# Altium project APP_1_huom2704.PrjPcb (part 1 of 3)
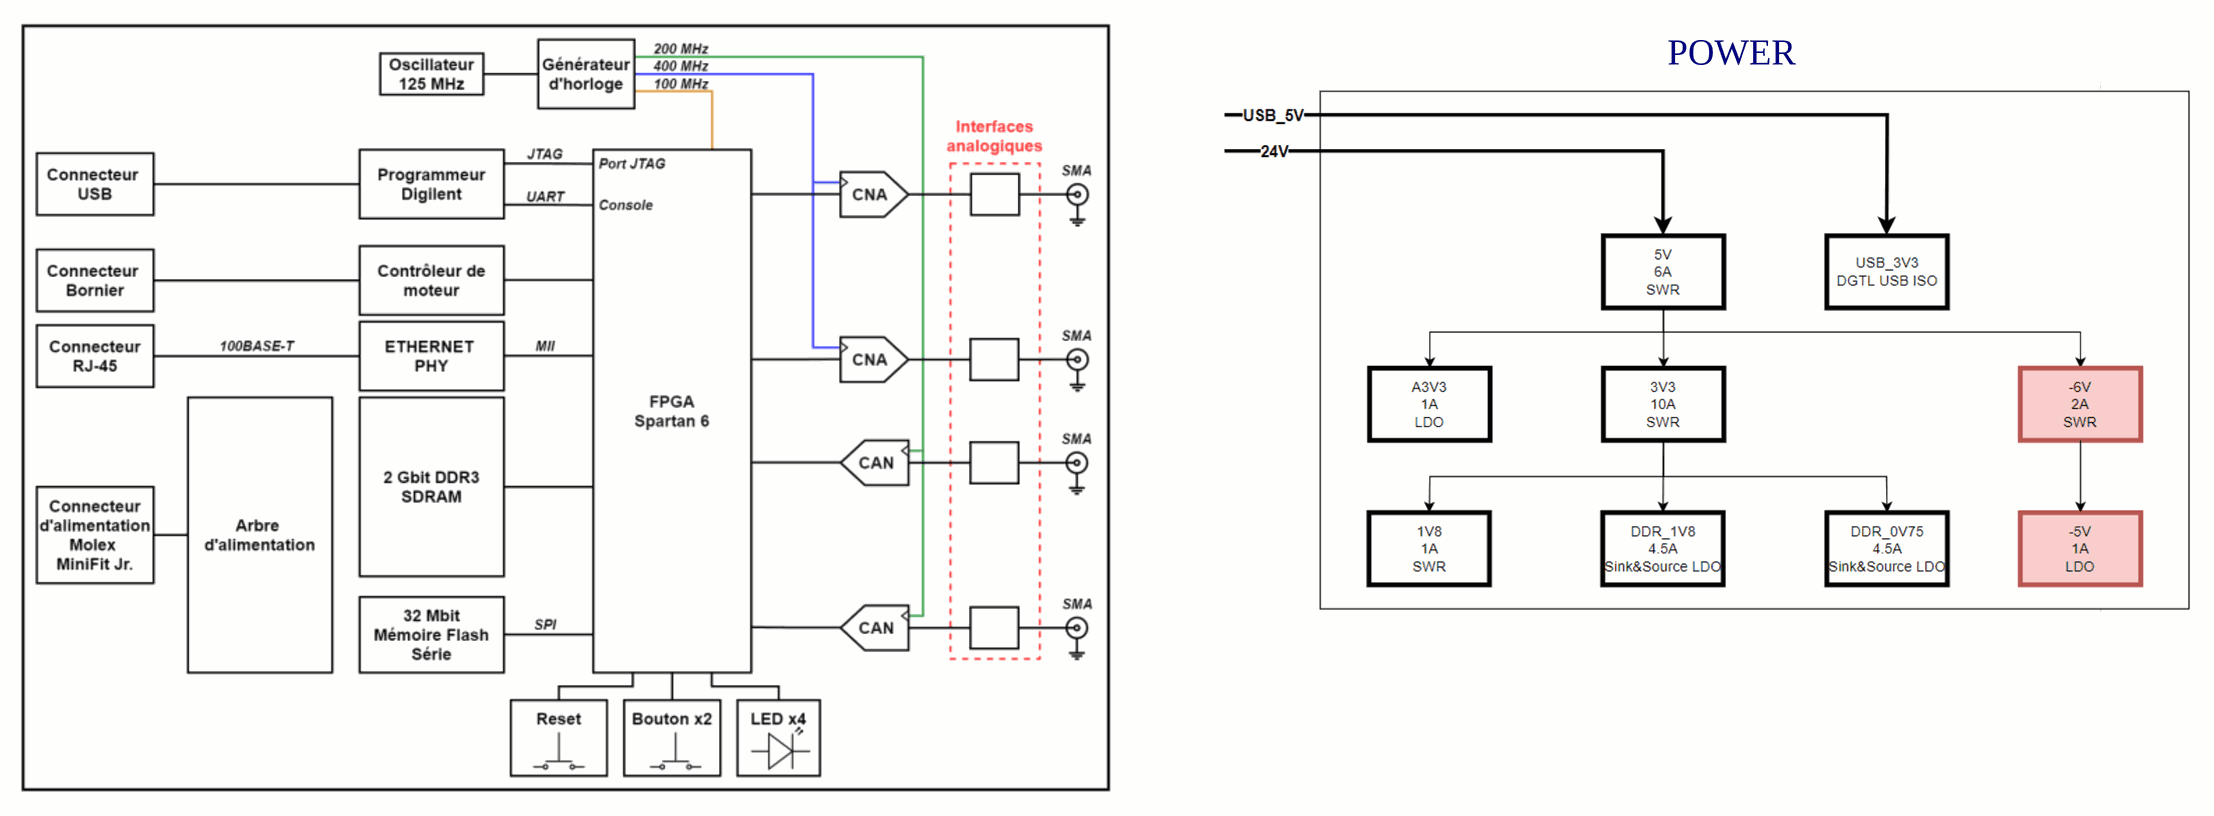
[diagram p0: APP_1_Overview.SchDoc]
Project_Date: 2024-01-12; Project_Designer1: Mathieu Huot; Project_Designer2: Emile Renaud; Project_Global: Conception PCB 1; Project_Group: N/A; Project_Name: APP_1_huom2704_rene0901; Project_Revision: 1.00
16 sheets, 396 parts. Net scope: flat (ports and power ports of the same name join across sheets).
Board files: APP_EMILE.PcbDoc, APP_1_PCB.PcbDoc
Sheets:
  APP_1_Title.SchDoc
  APP_1_Overview.SchDoc
  APP_1_Hiearchic.SchDoc
    FPGA = APP_1_FPGA_m.SchDoc
    DDR3 = APP_1_DDR3_m.SchDoc
    PLL = APP_1_PLL_m.SchDoc
    ADC = APP_1_ADC_m.SchDoc
    Connector = APP_1_Connectors_m.SchDoc
    DriveMoteur = APP_1_DriveMoteur_m.SchDoc
  APP_1_Power_m.SchDoc
  APP_1_Ethernet_m.SchDoc
  APP_1_Flash_m.SchDoc
  APP_1_DAC_m.SchDoc
  APP_1_JTAG_m.SchDoc
  APP_1_PowerAnalog.SchDoc
  APP_1_FPGA_2.SchDoc

## Sheet APP_1_Title.SchDoc
size Tabloid; DocumentNumber: 1; SheetNumber: 1; SheetTotal: 5; Sheet_Name: Insert name in Document Parameters; Size: 11x17

### Notes on the sheet
- Revision history
- Package size conversion
- Metric
- 1005
- 1608
- Imperial
- 0402
- 0603
- Revision
- 2012
- 3216
- 0805
- 1206
- 3225
- 6432
- 1210
- 2512
- Date :
- Project Title
- Global Project
- Size
- Date
- Group
- Sheet
- of
- Filename
- Designers

## Sheet APP_1_Overview.SchDoc: Overview
size Tabloid; DocumentNumber: 2; SheetNumber: 2; SheetTotal: 13; Sheet_Name: Overview; Size: 11x17

### Notes on the sheet
- POWER
- Sheet Name
- Project Title
- Global Project
- Size
- Group
- Revision
- Date
- Sheet
- of
- Filename
- Designers

## Sheet APP_1_Hiearchic.SchDoc
size Tabloid; SheetNumber: 3; SheetTotal: 14; Sheet_Name: Hierarchic; Size: 11x17
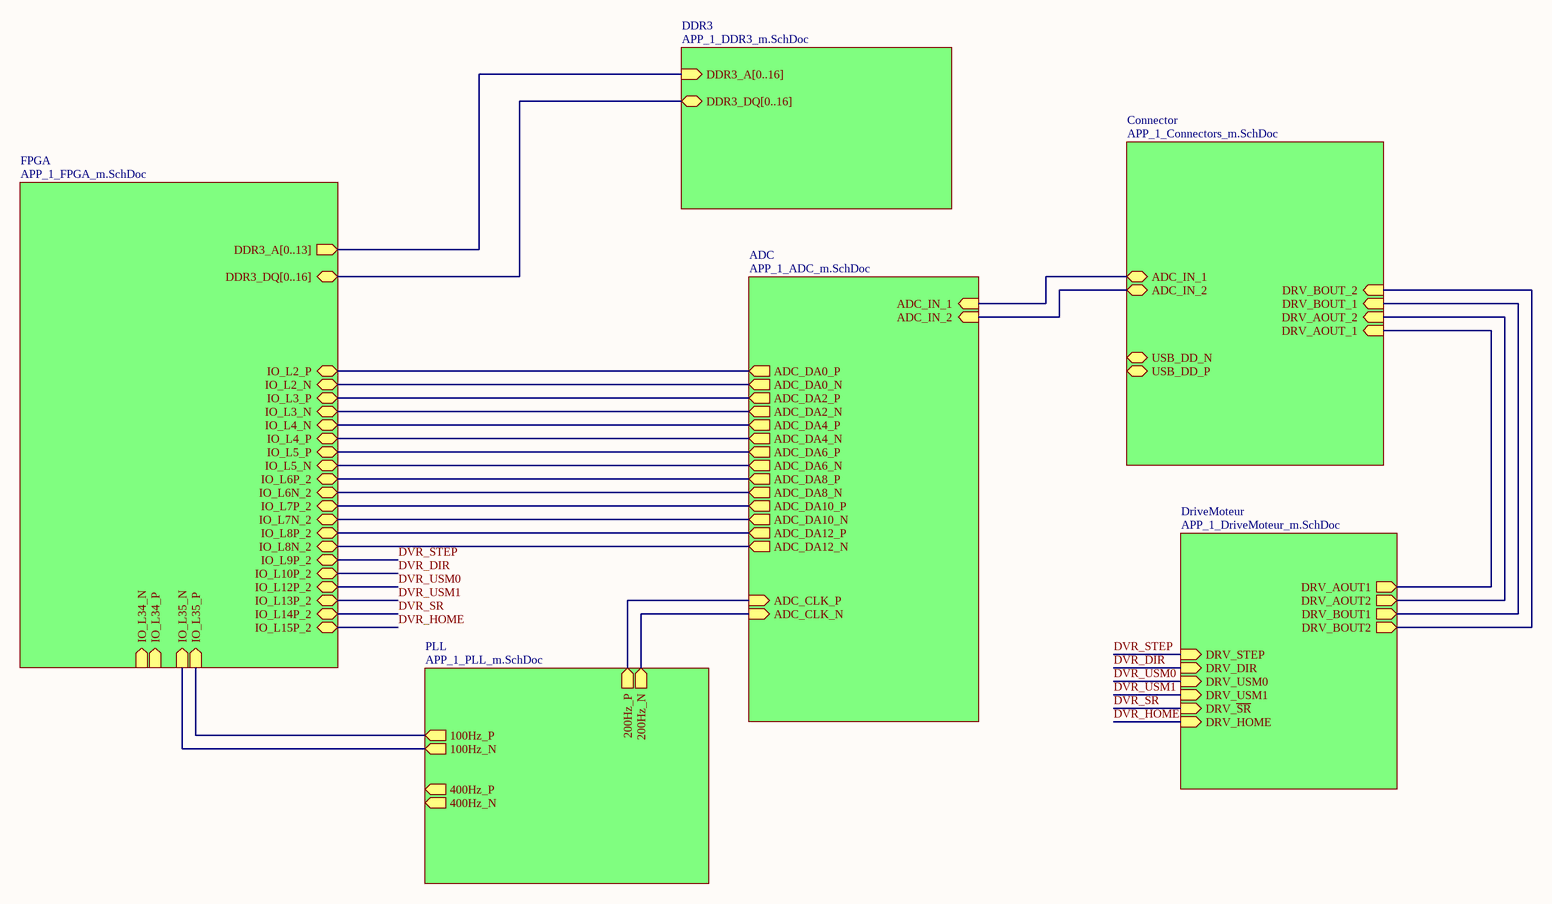
[diagram p1: APP_1_Hiearchic.SchDoc]

### Sub-sheets
ADC = APP_1_ADC_m.SchDoc: ADC_IN_1 (in), ADC_IN_2 (in), ADC_CLK_P (in), ADC_CLK_N (in), ADC_DA0_P (out), ADC_DA0_N (out), ADC_DA2_P (out), ADC_DA2_N (out), ADC_DA4_P (out), ADC_DA4_N (out), ADC_DA6_P (out), ADC_DA6_N (out), ADC_DA8_P (out), ADC_DA8_N (out), ADC_DA10_P (out), ADC_DA10_N (out), ADC_DA12_P (out), ADC_DA12_N (out)
Connector = APP_1_Connectors_m.SchDoc: ADC_IN_1 (bidir), ADC_IN_2 (bidir), DRV_AOUT_1 (in), DRV_AOUT_2 (in), DRV_BOUT_1 (in), DRV_BOUT_2 (in), USB_DD_P (bidir), USB_DD_N (bidir)
DDR3 = APP_1_DDR3_m.SchDoc: DDR3_A[0..16] (in), DDR3_DQ[0..16] (bidir)
DriveMoteur = APP_1_DriveMoteur_m.SchDoc: DRV_AOUT1 (out), DRV_AOUT2 (out), DRV_BOUT1 (out), DRV_BOUT2 (out), DRV_STEP (in), DRV_DIR (in), DRV_USM0 (in), DRV_USM1 (in), DRV_~{SR} (in), DRV_HOME (in)
FPGA = APP_1_FPGA_m.SchDoc: DDR3_A[0..13] (out), DDR3_DQ[0..16] (bidir), IO_L34_N (in), IO_L34_P (in), IO_L35_P (in), IO_L35_N (in), IO_L2_P (bidir), IO_L2_N (bidir), IO_L3_P (bidir), IO_L3_N (bidir), IO_L4_N (bidir), IO_L4_P (bidir), IO_L5_P (bidir), IO_L5_N (bidir), IO_L6P_2 (bidir), IO_L6N_2 (bidir), IO_L7P_2 (bidir), IO_L7N_2 (bidir), IO_L8P_2 (bidir), IO_L8N_2 (bidir), IO_L9P_2 (bidir), IO_L10P_2 (bidir), IO_L12P_2 (bidir), IO_L13P_2 (bidir), IO_L14P_2 (bidir), IO_L15P_2 (bidir)
PLL = APP_1_PLL_m.SchDoc: 100Hz_P (out), 100Hz_N (out), 200Hz_P (out), 200Hz_N (out), 400Hz_P (out), 400Hz_N (out)

### Nets
DVR_DIR: sheet FPGA/IO_L10P_2, sheet DriveMoteur/DRV_DIR
DVR_HOME: sheet FPGA/IO_L15P_2, sheet DriveMoteur/DRV_HOME
DVR_SR: sheet FPGA/IO_L14P_2, sheet DriveMoteur/DRV_~{SR}
DVR_STEP: sheet FPGA/IO_L9P_2, sheet DriveMoteur/DRV_STEP
DVR_USM0: sheet FPGA/IO_L12P_2, sheet DriveMoteur/DRV_USM0
DVR_USM1: sheet FPGA/IO_L13P_2, sheet DriveMoteur/DRV_USM1
(unnamed): sheet FPGA/IO_L35_P, sheet PLL/100Hz_P
(unnamed): sheet FPGA/IO_L35_N, sheet PLL/100Hz_N
(unnamed): sheet FPGA/IO_L2_P, sheet ADC/ADC_DA0_P
(unnamed): sheet FPGA/IO_L2_N, sheet ADC/ADC_DA0_N
(unnamed): sheet FPGA/IO_L3_P, sheet ADC/ADC_DA2_P
(unnamed): sheet FPGA/IO_L3_N, sheet ADC/ADC_DA2_N
(unnamed): sheet FPGA/IO_L4_N, sheet ADC/ADC_DA4_P
(unnamed): sheet FPGA/IO_L4_P, sheet ADC/ADC_DA4_N
(unnamed): sheet FPGA/IO_L5_P, sheet ADC/ADC_DA6_P
(unnamed): sheet FPGA/IO_L5_N, sheet ADC/ADC_DA6_N
(unnamed): sheet FPGA/IO_L6P_2, sheet ADC/ADC_DA8_P
(unnamed): sheet FPGA/IO_L6N_2, sheet ADC/ADC_DA8_N
(unnamed): sheet FPGA/IO_L7P_2, sheet ADC/ADC_DA10_P
(unnamed): sheet FPGA/IO_L7N_2, sheet ADC/ADC_DA10_N
(unnamed): sheet FPGA/IO_L8P_2, sheet ADC/ADC_DA12_P
(unnamed): sheet FPGA/IO_L8N_2, sheet ADC/ADC_DA12_N
(unnamed): sheet PLL/200Hz_P, sheet ADC/ADC_CLK_P
(unnamed): sheet PLL/200Hz_N, sheet ADC/ADC_CLK_N
(unnamed): sheet ADC/ADC_IN_1, sheet Connector/ADC_IN_1
(unnamed): sheet ADC/ADC_IN_2, sheet Connector/ADC_IN_2
(unnamed): sheet Connector/DRV_AOUT_1, sheet DriveMoteur/DRV_AOUT1
(unnamed): sheet Connector/DRV_AOUT_2, sheet DriveMoteur/DRV_AOUT2
(unnamed): sheet Connector/DRV_BOUT_1, sheet DriveMoteur/DRV_BOUT1
(unnamed): sheet Connector/DRV_BOUT_2, sheet DriveMoteur/DRV_BOUT2

### Buses and harness runs
bus sheet DDR3/DDR3_A[0..16] = sheet FPGA/DDR3_A[0..13]
bus sheet DDR3/DDR3_DQ[0..16] = sheet FPGA/DDR3_DQ[0..16]

### Notes on the sheet
- Sheet Name
- Project Title
- Global Project
- Size
- Group
- Revision
- Date
- Sheet
- of
- Filename
- Designers

## Sheet APP_1_FPGA_m.SchDoc
size Tabloid; SheetNumber: 5; SheetTotal: 16; Sheet_Name: FPGA_m; Size: 11x17
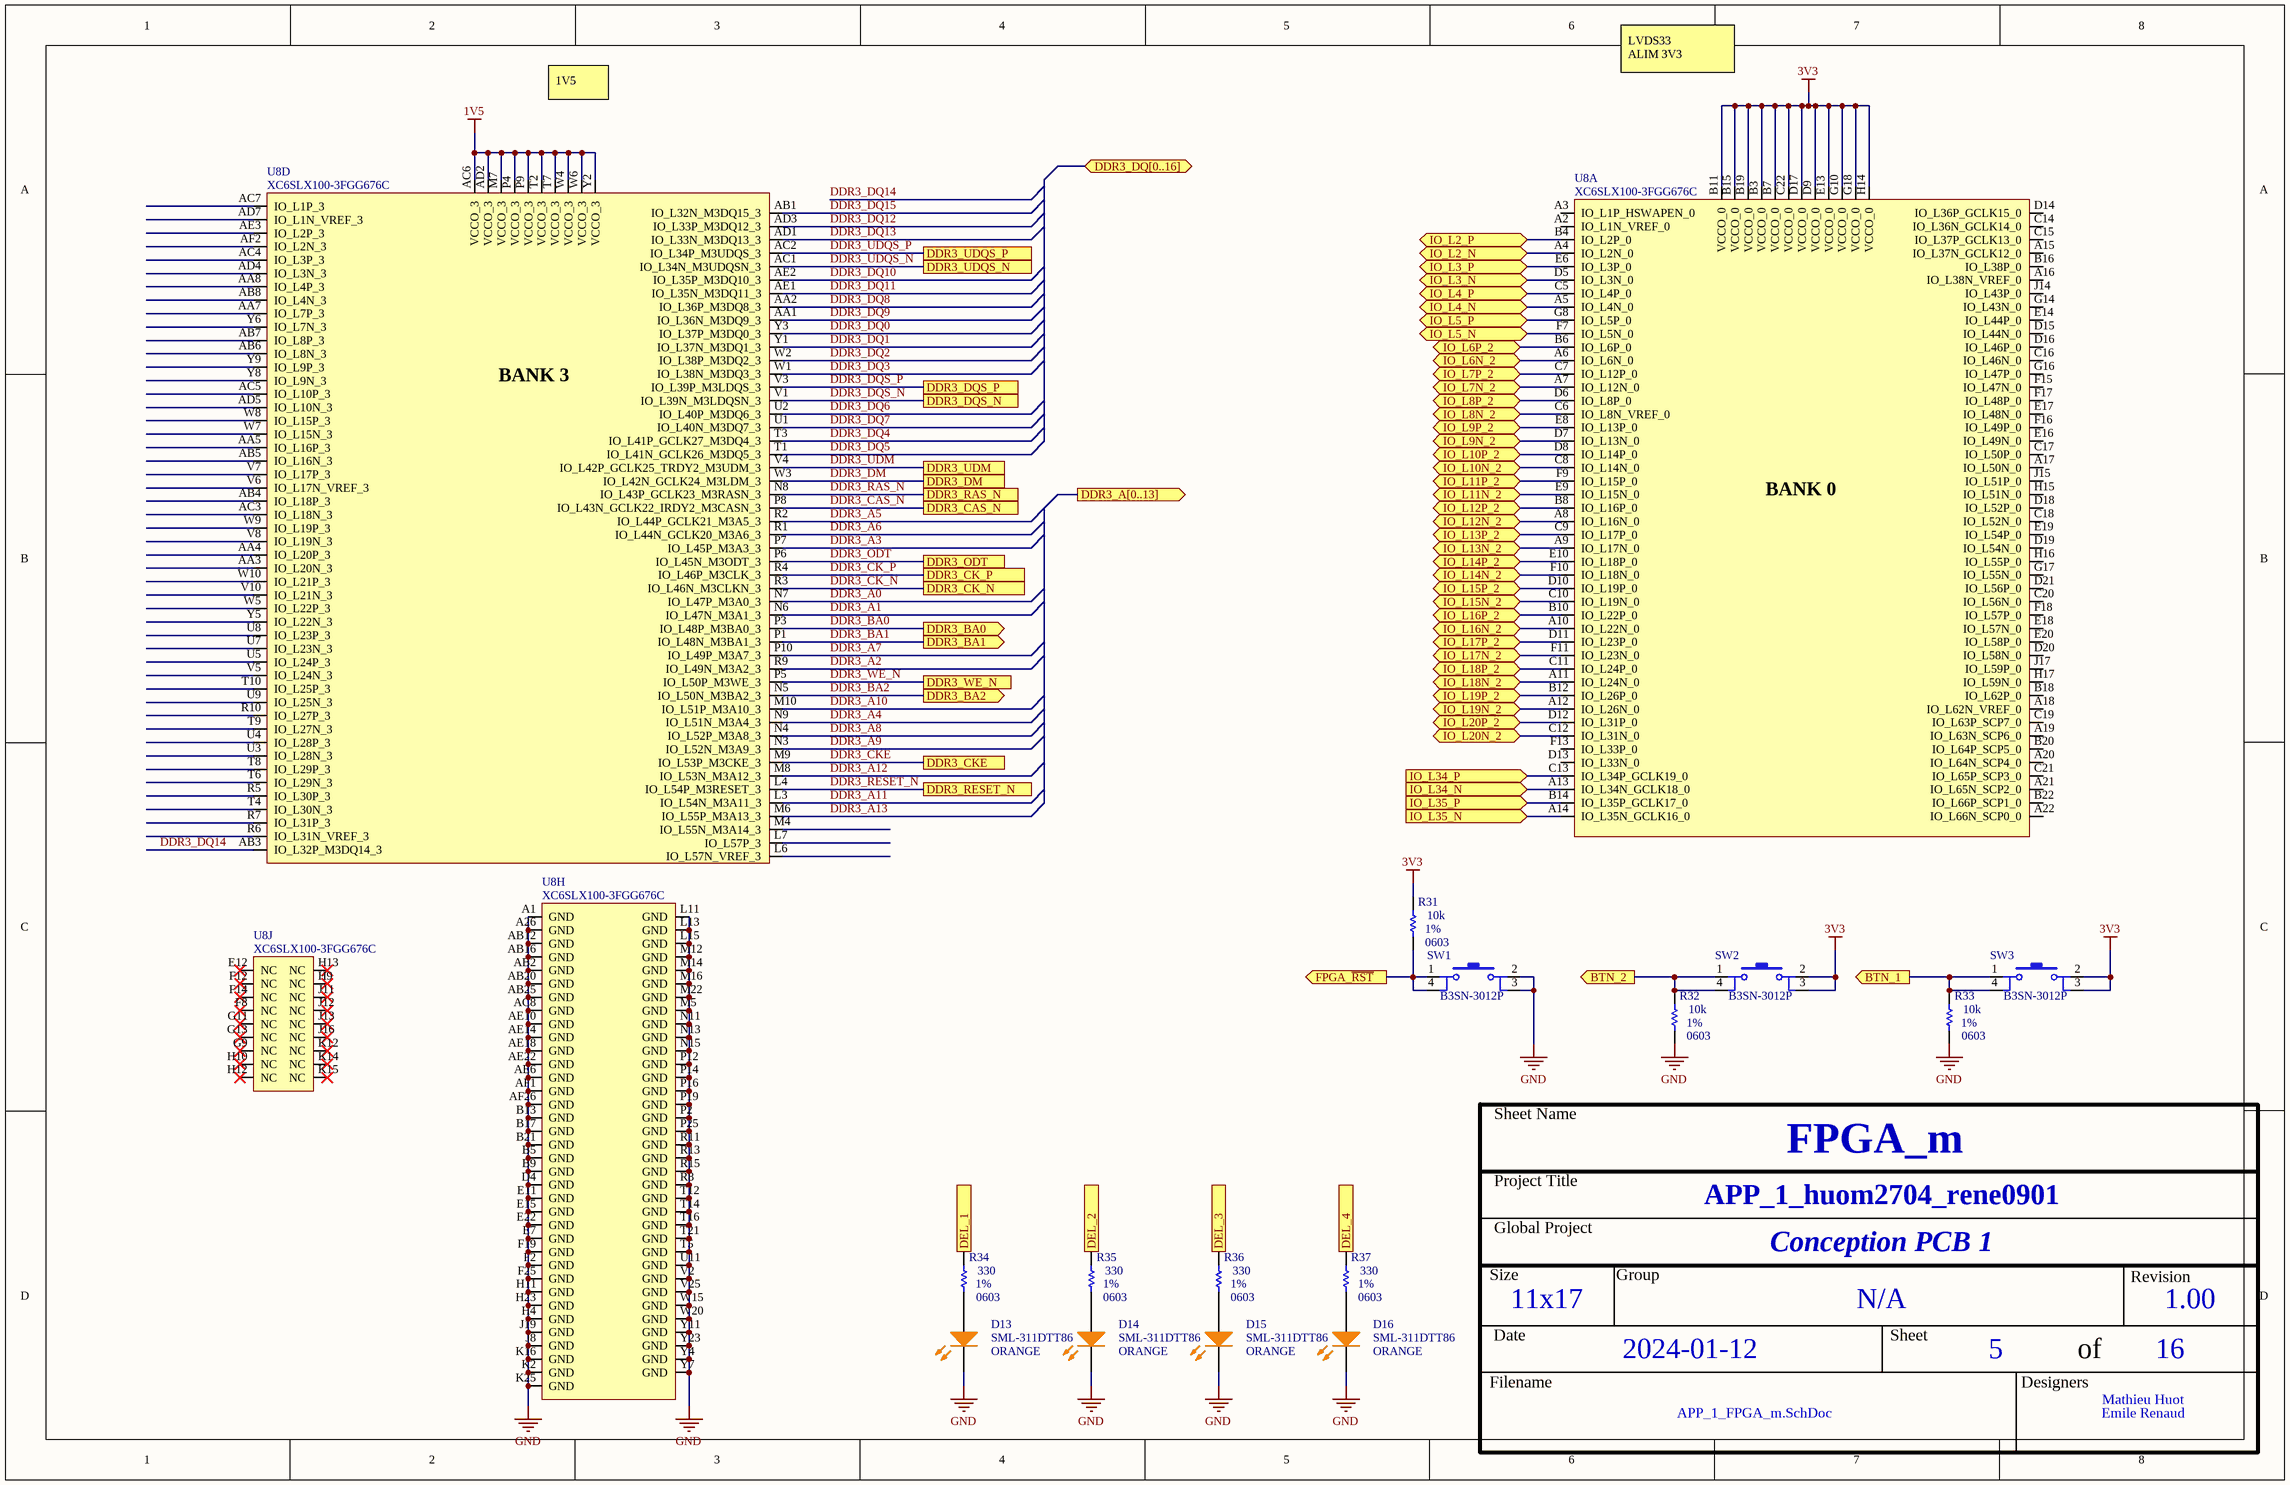
[diagram p2: APP_1_FPGA_m.SchDoc]

### Parts
D13  SML-311DTT86  value ORANGE  [LED_0603]
D14  SML-311DTT86  value ORANGE  [LED_0603]
D15  SML-311DTT86  value ORANGE  [LED_0603]
D16  SML-311DTT86  value ORANGE  [LED_0603]
R31  value 10k  Package: 0603  Precision: 1%  [RES_0603]  (hidden comment: RES - 0603)
R32  value 10k  Package: 0603  Precision: 1%  [RES_0603]  (hidden comment: RES - 0603)
R33  value 10k  Package: 0603  Precision: 1%  [RES_0603]  (hidden comment: RES - 0603)
R34  value 330  Package: 0603  Precision: 1%  [RES_0603]  (hidden comment: RES - 0603)
R35  value 330  Package: 0603  Precision: 1%  [RES_0603]  (hidden comment: RES - 0603)
R36  value 330  Package: 0603  Precision: 1%  [RES_0603]  (hidden comment: RES - 0603)
R37  value 330  Package: 0603  Precision: 1%  [RES_0603]  (hidden comment: RES - 0603)
SW1  B3SN-3012P  [SWI_TACT_B3SN-3012P]
SW2  B3SN-3012P  [SWI_TACT_B3SN-3012P]
SW3  B3SN-3012P  [SWI_TACT_B3SN-3012P]
U8  XC6SLX100-3FGG676C  [FPGA_XILINX_FGG676]  (parts A,D,H,J of 10)

### Ports
BTN_1 (out), BTN_2 (out), DDR3_A[0..13] (out, see APP_1_DDR3_m[1B]), DDR3_BA0 (out, see APP_1_DDR3_m[2C]), DDR3_BA1 (out, see APP_1_DDR3_m[2C]), DDR3_BA2 (out, see APP_1_DDR3_m[2C]), DDR3_CAS_N (see APP_1_DDR3_m[2C]), DDR3_CK_N (see APP_1_DDR3_m[1C]), DDR3_CK_P (see APP_1_DDR3_m[1C]), DDR3_CKE, DDR3_DM, DDR3_DQ[0..16] (bidir, see APP_1_DDR3_m[4B]), DDR3_DQS_N, DDR3_DQS_P, DDR3_ODT (see APP_1_DDR3_m[2C]), DDR3_RAS_N (see APP_1_DDR3_m[2C]), DDR3_RESET_N, DDR3_UDM (see APP_1_DDR3_m[4C]), DDR3_UDQS_N (see APP_1_DDR3_m[4C]), DDR3_UDQS_P (see APP_1_DDR3_m[4C]), DDR3_WE_N (see APP_1_DDR3_m[2C]), DEL_1, DEL_2, DEL_3, DEL_4, FPGA_~{RST} (out), IO_L2_N (bidir), IO_L2_P (bidir), IO_L3_N (bidir), IO_L3_P (bidir), IO_L4_N (bidir), IO_L4_P (bidir), IO_L5_N (bidir), IO_L5_P (bidir), IO_L6N_2 (bidir), IO_L6P_2 (bidir), IO_L7N_2 (bidir), IO_L7P_2 (bidir), IO_L8N_2 (bidir), IO_L8P_2 (bidir), IO_L9N_2 (bidir), IO_L9P_2 (bidir), IO_L10N_2 (bidir), IO_L10P_2 (bidir), IO_L11N_2 (bidir), IO_L11P_2 (bidir), IO_L12N_2 (bidir), IO_L12P_2 (bidir), IO_L13N_2 (bidir), IO_L13P_2 (bidir), IO_L14N_2 (bidir), IO_L14P_2 (bidir), IO_L15N_2 (bidir), IO_L15P_2 (bidir), IO_L16N_2 (bidir), IO_L16P_2 (bidir), IO_L17N_2 (bidir), IO_L17P_2 (bidir), IO_L18N_2 (bidir), IO_L18P_2 (bidir), IO_L19N_2 (bidir), IO_L19P_2 (bidir), IO_L20N_2 (bidir), IO_L20P_2 (bidir), IO_L34_N (in), IO_L34_P (in), IO_L35_N (in), IO_L35_P (in)

### Nets
1V5: U8.AC6(VCCO_3) U8.AD2(VCCO_3) U8.M7(VCCO_3) U8.P4(VCCO_3) U8.P9(VCCO_3) U8.T2(VCCO_3) U8.T7(VCCO_3) U8.W4(VCCO_3) U8.W6(VCCO_3) U8.Y2(VCCO_3)
3V3: R31.2 SW2.2 SW2.3 SW3.2 SW3.3 U8.B3(VCCO_0) U8.B7(VCCO_0) U8.B11(VCCO_0) U8.B15(VCCO_0) U8.B19(VCCO_0) U8.C22(VCCO_0) U8.D9(VCCO_0) U8.D17(VCCO_0) U8.E13(VCCO_0) U8.G10(VCCO_0) U8.G18(VCCO_0) U8.H14(VCCO_0)
GND: D13.K D14.K D15.K D16.K R32.1 R33.1 SW1.2 SW1.3 U8.A1(GND) U8.A26(GND) U8.AB2(GND) U8.AB12(GND) U8.AB16(GND) U8.AB20(GND) U8.AB25(GND) U8.AC8(GND) U8.AE6(GND) U8.AE10(GND) U8.AE14(GND) U8.AE18(GND) U8.AE22(GND) U8.AF1(GND) U8.AF26(GND) U8.B5(GND) U8.B9(GND) U8.B13(GND) U8.B17(GND) U8.B21(GND) U8.D4(GND) U8.E7(GND) U8.E11(GND) U8.E15(GND) U8.E22(GND) U8.F2(GND) U8.F19(GND) U8.F25(GND) U8.H4(GND) U8.H11(GND) U8.H23(GND) U8.J8(GND) U8.J19(GND) U8.K2(GND) U8.K16(GND) U8.K25(GND) U8.L11(GND) U8.L13(GND) U8.L15(GND) U8.M5(GND) U8.M12(GND) U8.M14(GND) U8.M16(GND) U8.M22(GND) U8.N11(GND) U8.N13(GND) U8.N15(GND) U8.P2(GND) U8.P12(GND) U8.P14(GND) U8.P16(GND) U8.P19(GND) U8.P25(GND) U8.R8(GND) U8.R11(GND) U8.R13(GND) U8.R15(GND) U8.T5(GND) U8.T12(GND) U8.T14(GND) U8.T16(GND) U8.T21(GND) U8.U11(GND) U8.V2(GND) U8.V25(GND) U8.W15(GND) U8.W20(GND) U8.Y4(GND) U8.Y7(GND) U8.Y11(GND) U8.Y23(GND)
BTN_1: R33.2 SW3.1 SW3.4 ; port BTN_1
BTN_2: R32.2 SW2.1 SW2.4 ; port BTN_2
DDR3_A0: U8.N7(IO_L47P_M3A0_3)
DDR3_A1: U8.N6(IO_L47N_M3A1_3)
DDR3_A2: U8.R9(IO_L49N_M3A2_3)
DDR3_A3: U8.P7(IO_L45P_M3A3_3)
DDR3_A4: U8.N9(IO_L51N_M3A4_3)
DDR3_A5: U8.R2(IO_L44P_GCLK21_M3A5_3)
DDR3_A6: U8.R1(IO_L44N_GCLK20_M3A6_3)
DDR3_A7: U8.P10(IO_L49P_M3A7_3)
DDR3_A8: U8.N4(IO_L52P_M3A8_3)
DDR3_A9: U8.N3(IO_L52N_M3A9_3)
DDR3_A10: U8.M10(IO_L51P_M3A10_3)
DDR3_A11: U8.L3(IO_L54N_M3A11_3)
DDR3_A12: U8.M8(IO_L53N_M3A12_3)
DDR3_A13: U8.M6(IO_L55P_M3A13_3)
DDR3_BA0: U8.P3(IO_L48P_M3BA0_3) ; port DDR3_BA0
DDR3_BA1: U8.P1(IO_L48N_M3BA1_3) ; port DDR3_BA1
DDR3_BA2: U8.N5(IO_L50N_M3BA2_3) ; port DDR3_BA2
DDR3_CAS_N: U8.P8(IO_L43N_GCLK22_IRDY2_M3CASN_3) ; port DDR3_CAS_N
DDR3_CK_N: U8.R3(IO_L46N_M3CLKN_3) ; port DDR3_CK_N
DDR3_CK_P: U8.R4(IO_L46P_M3CLK_3) ; port DDR3_CK_P
DDR3_CKE: U8.M9(IO_L53P_M3CKE_3) ; port DDR3_CKE
DDR3_DM: U8.W3(IO_L42N_GCLK24_M3LDM_3) ; port DDR3_DM
DDR3_DQ0: U8.Y3(IO_L37P_M3DQ0_3)
DDR3_DQ1: U8.Y1(IO_L37N_M3DQ1_3)
DDR3_DQ2: U8.W2(IO_L38P_M3DQ2_3)
DDR3_DQ3: U8.W1(IO_L38N_M3DQ3_3)
DDR3_DQ4: U8.T3(IO_L41P_GCLK27_M3DQ4_3)
DDR3_DQ5: U8.T1(IO_L41N_GCLK26_M3DQ5_3)
DDR3_DQ6: U8.U2(IO_L40P_M3DQ6_3)
DDR3_DQ7: U8.U1(IO_L40N_M3DQ7_3)
DDR3_DQ8: U8.AA2(IO_L36P_M3DQ8_3)
DDR3_DQ9: U8.AA1(IO_L36N_M3DQ9_3)
DDR3_DQ10: U8.AE2(IO_L35P_M3DQ10_3)
DDR3_DQ11: U8.AE1(IO_L35N_M3DQ11_3)
DDR3_DQ12: U8.AD3(IO_L33P_M3DQ12_3)
DDR3_DQ13: U8.AD1(IO_L33N_M3DQ13_3)
DDR3_DQ14: U8.AB3(IO_L32P_M3DQ14_3)
DDR3_DQ15: U8.AB1(IO_L32N_M3DQ15_3)
DDR3_DQS_N: U8.V1(IO_L39N_M3LDQSN_3) ; port DDR3_DQS_N
DDR3_DQS_P: U8.V3(IO_L39P_M3LDQS_3) ; port DDR3_DQS_P
DDR3_ODT: U8.P6(IO_L45N_M3ODT_3) ; port DDR3_ODT
DDR3_RAS_N: U8.N8(IO_L43P_GCLK23_M3RASN_3) ; port DDR3_RAS_N
DDR3_RESET_N: U8.L4(IO_L54P_M3RESET_3) ; port DDR3_RESET_N
DDR3_UDM: U8.V4(IO_L42P_GCLK25_TRDY2_M3UDM_3) ; port DDR3_UDM
DDR3_UDQS_N: U8.AC1(IO_L34N_M3UDQSN_3) ; port DDR3_UDQS_N
DDR3_UDQS_P: U8.AC2(IO_L34P_M3UDQS_3) ; port DDR3_UDQS_P
DDR3_WE_N: U8.P5(IO_L50P_M3WE_3) ; port DDR3_WE_N
DEL_1: R34.2 ; port DEL_1
DEL_2: R35.2 ; port DEL_2
DEL_3: R36.2 ; port DEL_3
DEL_4: R37.2 ; port DEL_4
FPGA_~{RST}: R31.1 SW1.1 SW1.4 ; port FPGA_~{RST}
IO_L2_N: U8.A4(IO_L2N_0) ; port IO_L2_N
IO_L2_P: U8.B4(IO_L2P_0) ; port IO_L2_P
IO_L3_N: U8.D5(IO_L3N_0) ; port IO_L3_N
IO_L3_P: U8.E6(IO_L3P_0) ; port IO_L3_P
IO_L4_N: U8.A5(IO_L4N_0) ; port IO_L4_N
IO_L4_P: U8.C5(IO_L4P_0) ; port IO_L4_P
IO_L5_N: U8.F7(IO_L5N_0) ; port IO_L5_N
IO_L5_P: U8.G8(IO_L5P_0) ; port IO_L5_P
IO_L6N_2: U8.A6(IO_L6N_0) ; port IO_L6N_2
IO_L6P_2: U8.B6(IO_L6P_0) ; port IO_L6P_2
IO_L7N_2: U8.A7(IO_L12N_0) ; port IO_L7N_2
IO_L7P_2: U8.C7(IO_L12P_0) ; port IO_L7P_2
IO_L8N_2: U8.C6(IO_L8N_VREF_0) ; port IO_L8N_2
IO_L8P_2: U8.D6(IO_L8P_0) ; port IO_L8P_2
IO_L9N_2: U8.D7(IO_L13N_0) ; port IO_L9N_2
IO_L9P_2: U8.E8(IO_L13P_0) ; port IO_L9P_2
IO_L10N_2: U8.C8(IO_L14N_0) ; port IO_L10N_2
IO_L10P_2: U8.D8(IO_L14P_0) ; port IO_L10P_2
IO_L11N_2: U8.E9(IO_L15N_0) ; port IO_L11N_2
IO_L11P_2: U8.F9(IO_L15P_0) ; port IO_L11P_2
IO_L12N_2: U8.A8(IO_L16N_0) ; port IO_L12N_2
IO_L12P_2: U8.B8(IO_L16P_0) ; port IO_L12P_2
IO_L13N_2: U8.A9(IO_L17N_0) ; port IO_L13N_2
IO_L13P_2: U8.C9(IO_L17P_0) ; port IO_L13P_2
IO_L14N_2: U8.F10(IO_L18N_0) ; port IO_L14N_2
IO_L14P_2: U8.E10(IO_L18P_0) ; port IO_L14P_2
IO_L15N_2: U8.C10(IO_L19N_0) ; port IO_L15N_2
IO_L15P_2: U8.D10(IO_L19P_0) ; port IO_L15P_2
IO_L16N_2: U8.A10(IO_L22N_0) ; port IO_L16N_2
IO_L16P_2: U8.B10(IO_L22P_0) ; port IO_L16P_2
IO_L17N_2: U8.F11(IO_L23N_0) ; port IO_L17N_2
IO_L17P_2: U8.D11(IO_L23P_0) ; port IO_L17P_2
IO_L18N_2: U8.A11(IO_L24N_0) ; port IO_L18N_2
IO_L18P_2: U8.C11(IO_L24P_0) ; port IO_L18P_2
IO_L19N_2: U8.A12(IO_L26N_0) ; port IO_L19N_2
IO_L19P_2: U8.B12(IO_L26P_0) ; port IO_L19P_2
IO_L20N_2: U8.C12(IO_L31N_0) ; port IO_L20N_2
IO_L20P_2: U8.D12(IO_L31P_0) ; port IO_L20P_2
IO_L34_N: U8.A13(IO_L34N_GCLK18_0) ; port IO_L34_N
IO_L34_P: U8.C13(IO_L34P_GCLK19_0) ; port IO_L34_P
IO_L35_N: U8.A14(IO_L35N_GCLK16_0) ; port IO_L35_N
IO_L35_P: U8.B14(IO_L35P_GCLK17_0) ; port IO_L35_P
NetD13_A: D13.A R34.1
NetD14_A: D14.A R35.1
NetD15_A: D15.A R36.1
NetD16_A: D16.A R37.1

Not connected (* = marked no-connect by the designer): U8 A2(IO_L1N_VREF_0) A3(IO_L1P_HSWAPEN_0) A15(IO_L37N_GCLK12_0) A16(IO_L38N_VREF_0) A17(IO_L50N_0) A18(IO_L62N_VREF_0) A19(IO_L63N_SCP6_0) A20(IO_L64N_SCP4_0) A21(IO_L65N_SCP2_0) A22(IO_L66N_SCP0_0) AA3(IO_L20N_3) AA4(IO_L20P_3) AA5(IO_L16P_3) AA7(IO_L7P_3) AA8(IO_L4P_3) AB4(IO_L18P_3) AB5(IO_L16N_3) AB6(IO_L8N_3) AB7(IO_L8P_3) AB8(IO_L4N_3) AC3(IO_L18N_3) AC4(IO_L3P_3) AC5(IO_L10P_3) AC7(IO_L1P_3) AD4(IO_L3N_3) AD5(IO_L10N_3) AD7(IO_L1N_VREF_3) AE3(IO_L2P_3) AF2(IO_L2N_3) B16(IO_L38P_0) B18(IO_L62P_0) B20(IO_L64P_SCP5_0) B22(IO_L66P_SCP1_0) C14(IO_L36N_GCLK14_0) C15(IO_L37P_GCLK13_0) C16(IO_L46N_0) C17(IO_L50P_0) C18(IO_L52N_0) C19(IO_L63P_SCP7_0) C20(IO_L56N_0) C21(IO_L65P_SCP3_0) D13(IO_L33N_0) D14(IO_L36P_GCLK15_0) D15(IO_L44N_0) D16(IO_L46P_0) D18(IO_L52P_0) D19(IO_L54N_0) D20(IO_L58N_0) D21(IO_L56P_0) E12(NC)* E14(IO_L44P_0) E16(IO_L49N_0) E17(IO_L48N_0) E18(IO_L57N_0) E19(IO_L54P_0) E20(IO_L58P_0) F8(NC)* F12(NC)* F13(IO_L33P_0) F14(NC)* F15(IO_L47N_0) F16(IO_L49P_0) F17(IO_L48P_0) F18(IO_L57P_0) G9(NC)* G11(NC)* G13(NC)* G14(IO_L43N_0) G16(IO_L47P_0) G17(IO_L55N_0) H9(NC)* H10(NC)* H12(NC)* H13(NC)* H15(IO_L51N_0) H16(IO_L55P_0) H17(IO_L59N_0) J11(NC)* J12(NC)* J13(NC)* J14(IO_L43P_0) J15(IO_L51P_0) J16(NC)* J17(IO_L59P_0) K12(NC)* K14(NC)* K15(NC)* L6(IO_L57N_VREF_3) L7(IO_L57P_3) M4(IO_L55N_M3A14_3) R5(IO_L30P_3) R6(IO_L31N_VREF_3) R7(IO_L31P_3) R10(IO_L27P_3) T4(IO_L30N_3) T6(IO_L29N_3) T8(IO_L29P_3) T9(IO_L27N_3) T10(IO_L25P_3) U3(IO_L28N_3) U4(IO_L28P_3) U5(IO_L24P_3) U7(IO_L23N_3) U8(IO_L23P_3) U9(IO_L25N_3) V5(IO_L24N_3) V6(IO_L17N_VREF_3) V7(IO_L17P_3) V8(IO_L19N_3) V10(IO_L21N_3) W5(IO_L22P_3) W7(IO_L15N_3) W8(IO_L15P_3) W9(IO_L19P_3) W10(IO_L21P_3) Y5(IO_L22N_3) Y6(IO_L7N_3) Y8(IO_L9N_3) Y9(IO_L9P_3)

### Notes on the sheet
- 1V5
- LVDS33
  ALIM 3V3
- Sheet Name
- Project Title
- Global Project
- Size
- Group
- Revision
- Date
- Sheet
- of
- Filename
- Designers
- (in symbol FPGA_XC6SLX100-3FGG676C, part A) BANK 0
- (in symbol FPGA_XC6SLX100-3FGG676C, part D) BANK 3

### Library data of the parts
D13-D16 = LED_SML-311DTT86: LED - 611nM ORANGE 2mA - 0603; Voltage: 1.8V; Mfg: ROHM Semiconductor; Power: 44mW; Current: 2mA; HelpURL: http://media.digikey.com/pdf/Data%20Sheets/Rohm%20PDFs/SML-311%20Series.pdf; CreatedBy: Jonathan Bouchard; Temperature: -40°C to 85°C; Package: 0603; Precision: *; Mfg Part Number: SML-311DTT86; Supplier 1: Digikey; Supplier Part Number 1: 511-1303-1-ND
SW1-SW3 = SWI_TACT_B3SN-3012P: SWI - TACT SPST-NO 0.05A 24V - 4-SMD; Current: 50mA; Mfg: Omron; Mfg Part Number: B3SN-3012P; HelpURL: http://www.omron.com/ecb/products/pdf/en-b3sn.pdf; CreatedBy: Jonathan Bouchard; Temperature: -25°C ~ 70°C; Power: *; Precision: *; Package: 4-SMD; Value: *; Voltage: 24V; Supplier 1: Digikey; Supplier Part Number 1: SW261CT-ND
U8 = FPGA_XC6SLX100-3FGG676C: FPGA - XILINX SPARTAN 6 480 I/O - BGA-676; Voltage: 1.14 V ~ 1.26 V; Current: *; Power: *; Mfg: Xilinx; Mfg Part Number: XC6SLX100-3FGG676C; HelpURL: https://www.xilinx.com/support/documentation/data_sheets/ds162.pdf; CreatedBy: Jonathan Bouchard; Temperature: 0°C ~ 85°C (TJ); Value: *; Precision: *; Package: BGA-676; Supplier 1: Digikey; Supplier Part Number 1: 122-1760-ND
R31-R37 = RES - 0603: Current: *; CreatedBy: Jonathan Bouchard

## Sheet APP_1_DDR3_m.SchDoc
size Tabloid; SheetNumber: 6; SheetTotal: 16; Sheet_Name: DDR3_m; Size: 11x17
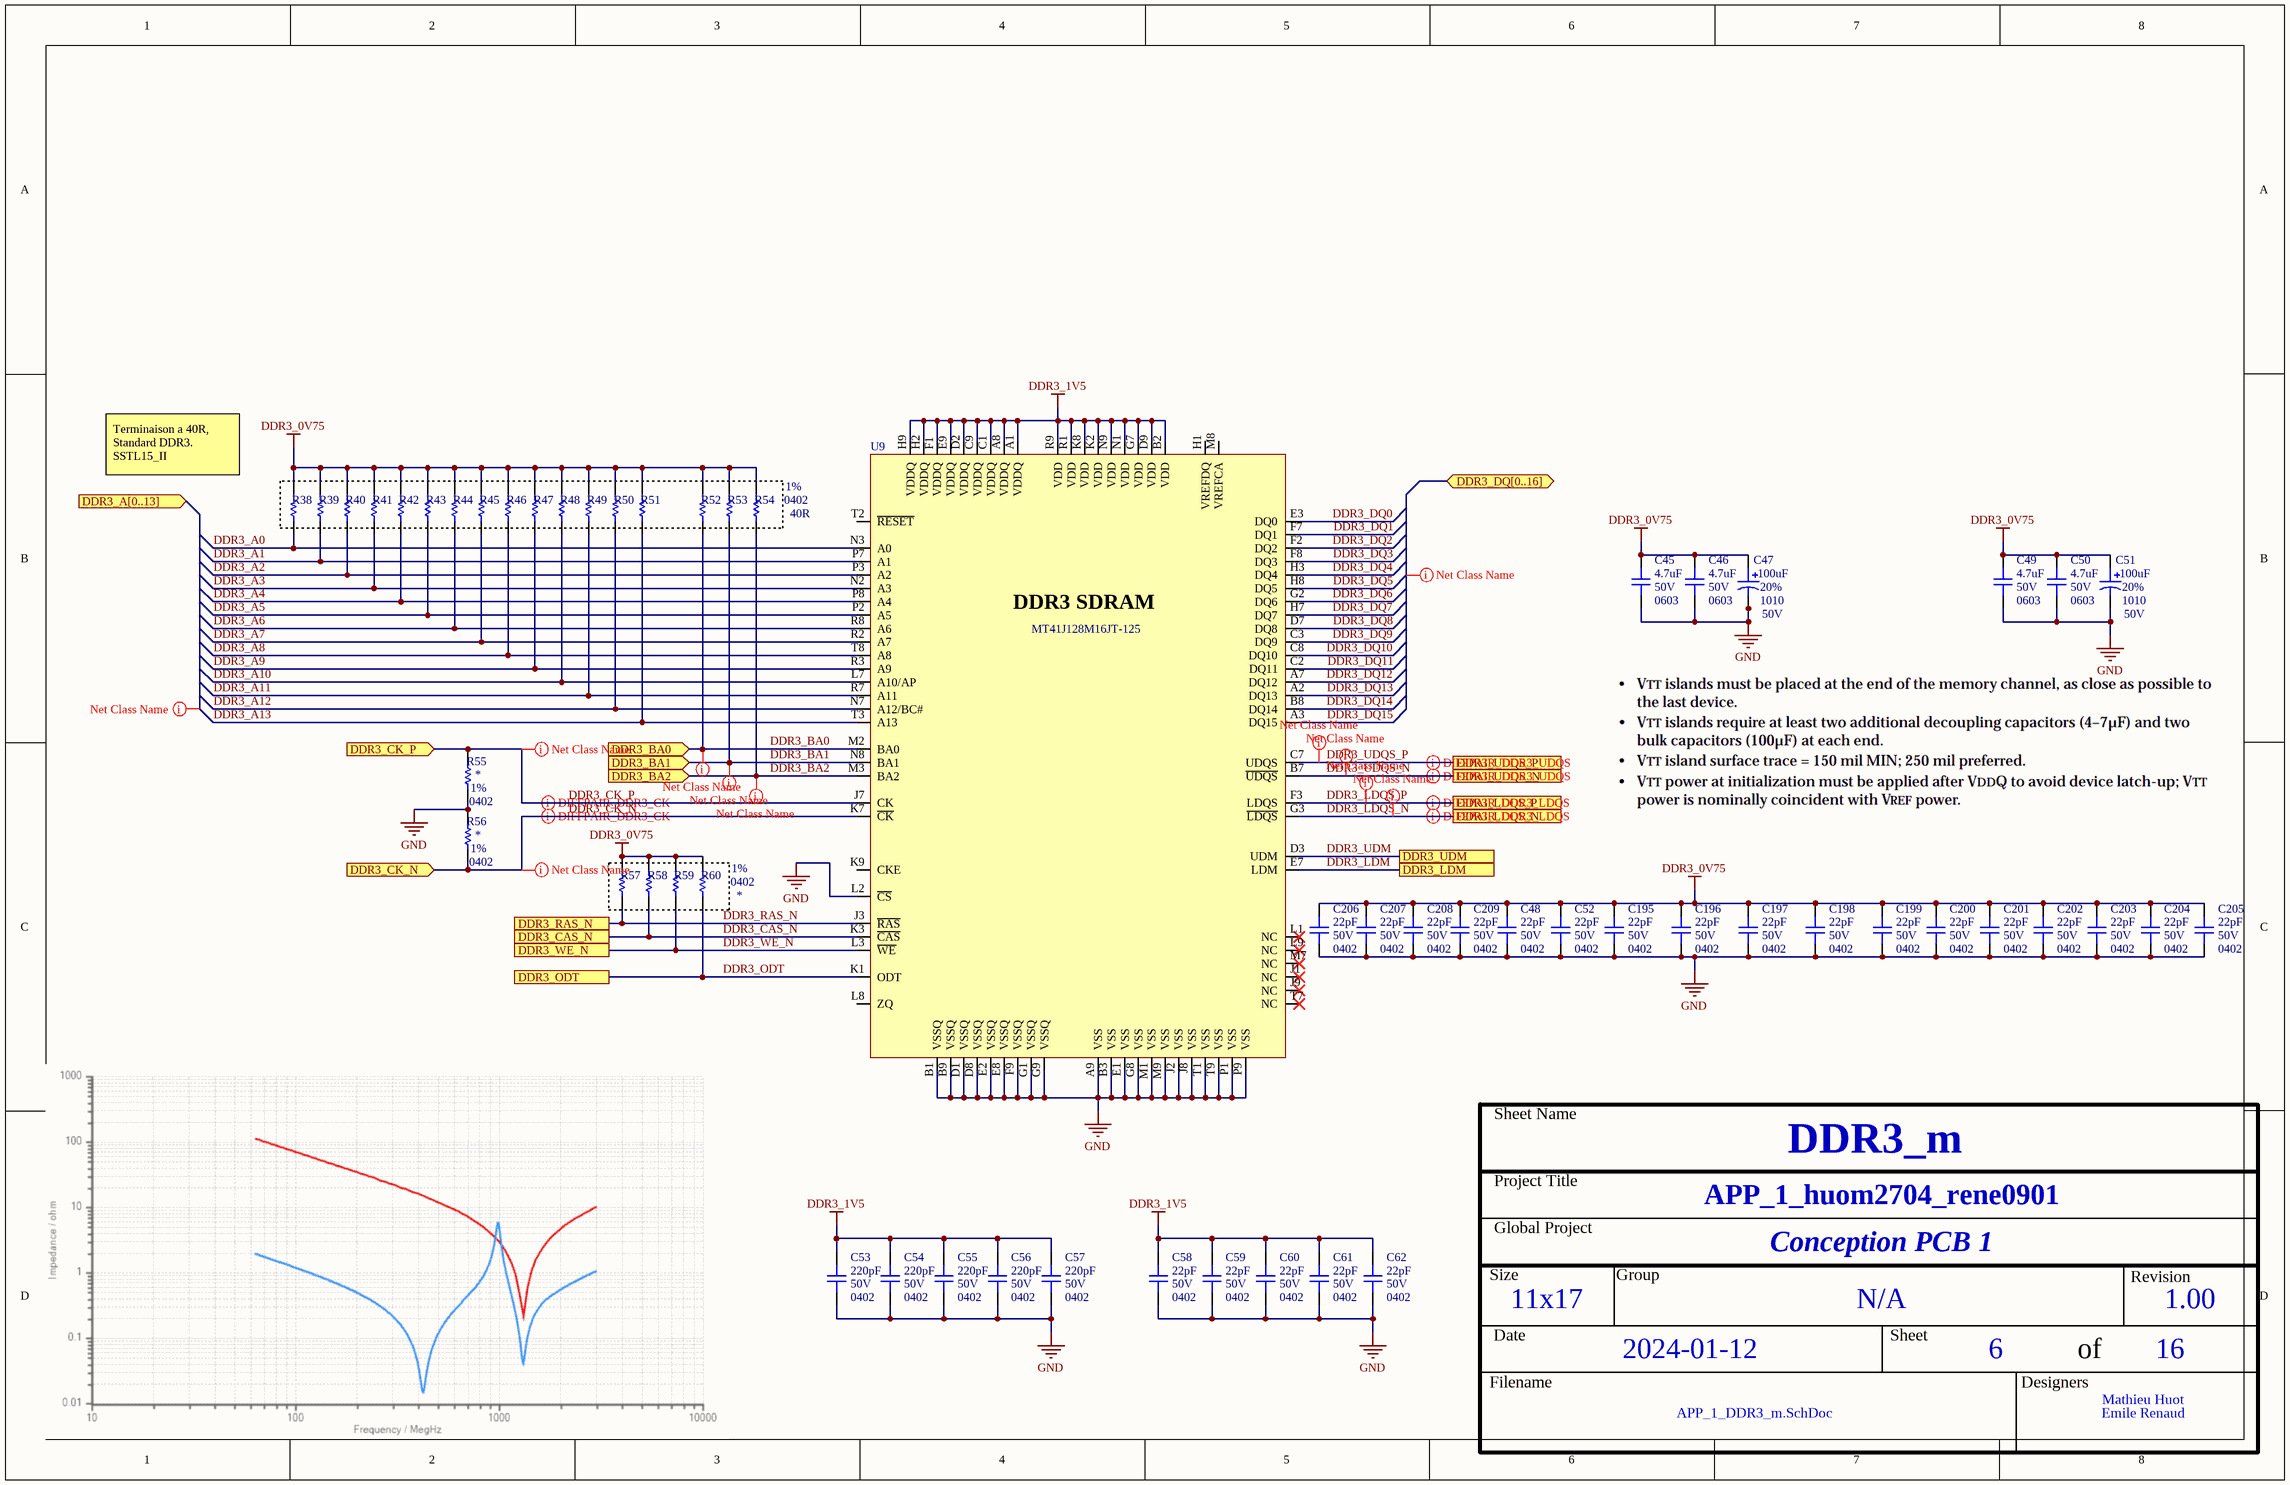
[diagram p3: APP_1_DDR3_m.SchDoc]

### Parts
C45  value 4.7uF  Voltage: 50V  Package: 0603  [CAP_0603]  (hidden comment: CAP - 0603)
C46  value 4.7uF  Voltage: 50V  Package: 0603  [CAP_0603]  (hidden comment: CAP - 0603)
C47  value 100uF  Voltage: 50V  Package: 1010  Precision: 20%  [CAP_ALU_1010_vishay]  (hidden comment: MAL215099101E3)
C48  value 22pF  Voltage: 50V  Package: 0402  [CAP_0402]  (hidden comment: CAP - 0402)
C49  value 4.7uF  Voltage: 50V  Package: 0603  [CAP_0603]  (hidden comment: CAP - 0603)
C50  value 4.7uF  Voltage: 50V  Package: 0603  [CAP_0603]  (hidden comment: CAP - 0603)
C51  value 100uF  Voltage: 50V  Package: 1010  Precision: 20%  [CAP_ALU_1010_vishay]  (hidden comment: MAL215099101E3)
C52  value 22pF  Voltage: 50V  Package: 0402  [CAP_0402]  (hidden comment: CAP - 0402)
C53  value 220pF  Voltage: 50V  Package: 0402  [CAP_0402]  (hidden comment: CAP - 0402)
C54  value 220pF  Voltage: 50V  Package: 0402  [CAP_0402]  (hidden comment: CAP - 0402)
C55  value 220pF  Voltage: 50V  Package: 0402  [CAP_0402]  (hidden comment: CAP - 0402)
C56  value 220pF  Voltage: 50V  Package: 0402  [CAP_0402]  (hidden comment: CAP - 0402)
C57  value 220pF  Voltage: 50V  Package: 0402  [CAP_0402]  (hidden comment: CAP - 0402)
C58  value 22pF  Voltage: 50V  Package: 0402  [CAP_0402]  (hidden comment: CAP - 0402)
C59  value 22pF  Voltage: 50V  Package: 0402  [CAP_0402]  (hidden comment: CAP - 0402)
C60  value 22pF  Voltage: 50V  Package: 0402  [CAP_0402]  (hidden comment: CAP - 0402)
C61  value 22pF  Voltage: 50V  Package: 0402  [CAP_0402]  (hidden comment: CAP - 0402)
C62  value 22pF  Voltage: 50V  Package: 0402  [CAP_0402]  (hidden comment: CAP - 0402)
C195  value 22pF  Voltage: 50V  Package: 0402  [CAP_0402]  (hidden comment: CAP - 0402)
C196  value 22pF  Voltage: 50V  Package: 0402  [CAP_0402]  (hidden comment: CAP - 0402)
C197  value 22pF  Voltage: 50V  Package: 0402  [CAP_0402]  (hidden comment: CAP - 0402)
C198  value 22pF  Voltage: 50V  Package: 0402  [CAP_0402]  (hidden comment: CAP - 0402)
C199  value 22pF  Voltage: 50V  Package: 0402  [CAP_0402]  (hidden comment: CAP - 0402)
C200  value 22pF  Voltage: 50V  Package: 0402  [CAP_0402]  (hidden comment: CAP - 0402)
C201  value 22pF  Voltage: 50V  Package: 0402  [CAP_0402]  (hidden comment: CAP - 0402)
C202  value 22pF  Voltage: 50V  Package: 0402  [CAP_0402]  (hidden comment: CAP - 0402)
C203  value 22pF  Voltage: 50V  Package: 0402  [CAP_0402]  (hidden comment: CAP - 0402)
C204  value 22pF  Voltage: 50V  Package: 0402  [CAP_0402]  (hidden comment: CAP - 0402)
C205  value 22pF  Voltage: 50V  Package: 0402  [CAP_0402]  (hidden comment: CAP - 0402)
C206  value 22pF  Voltage: 50V  Package: 0402  [CAP_0402]  (hidden comment: CAP - 0402)
C207  value 22pF  Voltage: 50V  Package: 0402  [CAP_0402]  (hidden comment: CAP - 0402)
C208  value 22pF  Voltage: 50V  Package: 0402  [CAP_0402]  (hidden comment: CAP - 0402)
C209  value 22pF  Voltage: 50V  Package: 0402  [CAP_0402]  (hidden comment: CAP - 0402)
R38  RES - 0402  [RES_0402]  (value not drawn)
R39  RES - 0402  [RES_0402]  (value not drawn)
R40  RES - 0402  [RES_0402]  (value not drawn)
R41  RES - 0402  [RES_0402]  (value not drawn)
R42  RES - 0402  [RES_0402]  (value not drawn)
R43  RES - 0402  [RES_0402]  (value not drawn)
R44  RES - 0402  [RES_0402]  (value not drawn)
R45  RES - 0402  [RES_0402]  (value not drawn)
R46  RES - 0402  [RES_0402]  (value not drawn)
R47  RES - 0402  [RES_0402]  (value not drawn)
R48  RES - 0402  [RES_0402]  (value not drawn)
R49  RES - 0402  [RES_0402]  (value not drawn)
R50  RES - 0402  [RES_0402]  (value not drawn)
R51  RES - 0402  [RES_0402]  (value not drawn)
R52  RES - 0402  [RES_0402]  (value not drawn)
R53  RES - 0402  [RES_0402]  (value not drawn)
R54  value 40R  Package: 0402  Precision: 1%  [RES_0402]  (hidden comment: RES - 0402)
R55  Package: 0402  Precision: 1%  [RES_0402]  (hidden comment: RES - 0402)
R56  Package: 0402  Precision: 1%  [RES_0402]  (hidden comment: RES - 0402)
R57  RES - 0402  [RES_0402]  (value not drawn)
R58  RES - 0402  [RES_0402]  (value not drawn)
R59  RES - 0402  [RES_0402]  (value not drawn)
R60  Package: 0402  Precision: 1%  [RES_0402]  (hidden comment: RES - 0402)
U9  MT41J128M16JT-125  [MEM_DDR3_MT41J128M16JT-125]

### Ports
DDR3_A[0..13] (in, see APP_1_FPGA_m[3B]), DDR3_BA0 (in, see APP_1_FPGA_m[3B]), DDR3_BA1 (in, see APP_1_FPGA_m[3B]), DDR3_BA2 (in, see APP_1_FPGA_m[3B]), DDR3_CAS_N (see APP_1_FPGA_m[3B]), DDR3_CK_N (in, see APP_1_FPGA_m[3B]), DDR3_CK_P (in, see APP_1_FPGA_m[3B]), DDR3_DQ[0..16] (bidir, see APP_1_FPGA_m[3A]), DDR3_LDM, DDR3_LDQS_N, DDR3_LDQS_P, DDR3_ODT (see APP_1_FPGA_m[3B]), DDR3_RAS_N (see APP_1_FPGA_m[3B]), DDR3_UDM (see APP_1_FPGA_m[3B]), DDR3_UDQS_N (see APP_1_FPGA_m[3A]), DDR3_UDQS_P (see APP_1_FPGA_m[3A]), DDR3_WE_N (see APP_1_FPGA_m[3B])

### Nets
DDR3_0V75: C45.2 C46.2 C47.1 C48.2 C49.2 C50.2 C51.1 C52.2 C195.2 C196.2 C197.2 C198.2 C199.2 C200.2 C201.2 C202.2 C203.2 C204.2 C205.2 C206.2 C207.2 C208.2 C209.2 R38.2 R39.2 R40.2 R41.2 R42.2 R43.2 R44.2 R45.2 R46.2 R47.2 R48.2 R49.2 R50.2 R51.2 R52.2 R53.2 R54.2 R57.2 R58.2 R59.2 R60.2
DDR3_1V5: C53.2 C54.2 C55.2 C56.2 C57.2 C58.2 C59.2 C60.2 C61.2 C62.2 U9.A1(VDDQ) U9.A8(VDDQ) U9.B2(VDD) U9.C1(VDDQ) U9.C9(VDDQ) U9.D2(VDDQ) U9.D9(VDD) U9.E9(VDDQ) U9.F1(VDDQ) U9.G7(VDD) U9.H2(VDDQ) U9.H9(VDDQ) U9.K2(VDD) U9.K8(VDD) U9.N1(VDD) U9.N9(VDD) U9.R1(VDD) U9.R9(VDD)
GND: C45.1 C46.1 C47.2 C48.1 C49.1 C50.1 C51.2 C52.1 C53.1 C54.1 C55.1 C56.1 C57.1 C58.1 C59.1 C60.1 C61.1 C62.1 C195.1 C196.1 C197.1 C198.1 C199.1 C200.1 C201.1 C202.1 C203.1 C204.1 C205.1 C206.1 C207.1 C208.1 C209.1 R55.1 R56.2 U9.A9(VSS) U9.B1(VSSQ) U9.B3(VSS) U9.B9(VSSQ) U9.D1(VSSQ) U9.D8(VSSQ) U9.E1(VSS) U9.E2(VSSQ) U9.E8(VSSQ) U9.F9(VSSQ) U9.G1(VSSQ) U9.G8(VSS) U9.G9(VSSQ) U9.J2(VSS) U9.J8(VSS) U9.L2(~{CS}) U9.M1(VSS) U9.M9(VSS) U9.P1(VSS) U9.P9(VSS) U9.T1(VSS) U9.T9(VSS)
DDR3_A0: R38.1 U9.N3(A0)
DDR3_A1: R39.1 U9.P7(A1)
DDR3_A2: R40.1 U9.P3(A2)
DDR3_A3: R41.1 U9.N2(A3)
DDR3_A4: R42.1 U9.P8(A4)
DDR3_A5: R43.1 U9.P2(A5)
DDR3_A6: R44.1 U9.R8(A6)
DDR3_A7: R45.1 U9.R2(A7)
DDR3_A8: R46.1 U9.T8(A8)
DDR3_A9: R47.1 U9.R3(A9)
DDR3_A10: R48.1 U9.L7(A10/AP)
DDR3_A11: R49.1 U9.R7(A11)
DDR3_A12: R50.1 U9.N7(A12/BC#)
DDR3_A13: R51.1 U9.T3(A13)
DDR3_BA0: R52.1 U9.M2(BA0) ; port DDR3_BA0
DDR3_BA1: R53.1 U9.N8(BA1) ; port DDR3_BA1
DDR3_BA2: R54.1 U9.M3(BA2) ; port DDR3_BA2
DDR3_CAS_N: R58.1 U9.K3(~{CAS}) ; port DDR3_CAS_N
DDR3_CK_N: R56.1 U9.K7(~{CK}) ; port DDR3_CK_N
DDR3_CK_P: R55.2 U9.J7(CK) ; port DDR3_CK_P
DDR3_DQ0: U9.E3(DQ0)
DDR3_DQ1: U9.F7(DQ1)
DDR3_DQ2: U9.F2(DQ2)
DDR3_DQ3: U9.F8(DQ3)
DDR3_DQ4: U9.H3(DQ4)
DDR3_DQ5: U9.H8(DQ5)
DDR3_DQ6: U9.G2(DQ6)
DDR3_DQ7: U9.H7(DQ7)
DDR3_DQ8: U9.D7(DQ8)
DDR3_DQ9: U9.C3(DQ9)
DDR3_DQ10: U9.C8(DQ10)
DDR3_DQ11: U9.C2(DQ11)
DDR3_DQ12: U9.A7(DQ12)
DDR3_DQ13: U9.A2(DQ13)
DDR3_DQ14: U9.B8(DQ14)
DDR3_DQ15: U9.A3(DQ15)
DDR3_LDM: U9.E7(LDM) ; port DDR3_LDM
DDR3_LDQS_N: U9.G3(~{LDQS}) ; port DDR3_LDQS_N
DDR3_LDQS_P: U9.F3(LDQS) ; port DDR3_LDQS_P
DDR3_ODT: R60.1 U9.K1(ODT) ; port DDR3_ODT
DDR3_RAS_N: R57.1 U9.J3(~{RAS}) ; port DDR3_RAS_N
DDR3_UDM: U9.D3(UDM) ; port DDR3_UDM
DDR3_UDQS_N: U9.B7(~{UDQS}) ; port DDR3_UDQS_N
DDR3_UDQS_P: U9.C7(UDQS) ; port DDR3_UDQS_P
DDR3_WE_N: R59.1 U9.L3(~{WE}) ; port DDR3_WE_N

Not connected (* = marked no-connect by the designer): U9 H1(VREFDQ) J1(NC)* J9(NC)* K9(CKE) L1(NC)* L8(ZQ) L9(NC)* M7(NC)* M8(VREFCA) T2(~{RESET}) T7(NC)*

### Layout directives
differential pair: DDR3_CK_N, DDR3_CK_P, DDR3_LDQS_N, DDR3_LDQS_P, DDR3_UDQS_N, DDR3_UDQS_P
net class DDR3_A[0..13]: (no net found under the mark)
net class DDR3_BA: DDR3_BA0, DDR3_BA1, DDR3_BA2
net class DDR3_DQ[0..16]: (no net found under the mark)
net class DDR3_CLK: DDR3_CK_N, DDR3_CK_P, DDR3_LDQS_N, DDR3_LDQS_P, DDR3_UDQS_N, DDR3_UDQS_P

### Notes on the sheet
- Terminaison a 40R, Standard DDR3. SSTL15_II
- Sheet Name
- Project Title
- Global Project
- Size
- Group
- Revision
- Date
- Sheet
- of
- Filename
- Designers
- (in symbol MEM_DDR3_MT41J128M16JT-125:K TR) DDR3 SDRAM

### Library data of the parts
C45 C46 C49 C50 = CAP - 0603: Precision: 10%; Current: *; CreatedBy: Jonathan Bouchard; Power: *
C47 C51 = CAP_ALU_MAL215099101E3: CAP - ALU 100uF 20% 50V - 1010; Current: 490mA; Mfg: Vishay Dale; Mfg Part Number: MAL215099101E3; HelpURL: http://www.vishay.com/docs/28395/150crz.pdf; CreatedBy: Jonathan Bouchard; Temperature: -55°C to 125°C; Power: *; Supplier 1: Digikey; Supplier Part Number 1: 4399PHDKR-ND
C48 C52-C62 C195-C209 = CAP - 0402: Precision: 10%; Current: *; CreatedBy: Jonathan Bouchard; Power: *
R38-R53 R57-R59 = RES - 0402: Voltage: 50V; Power: 1/16W; Precision: 1%; Current: *; CreatedBy: Jonathan Bouchard; Package: 0402; Value: *
R54-R56 R60 = RES - 0402: Voltage: 50V; Power: 1/16W; Current: *; CreatedBy: Jonathan Bouchard
  R55 R56 R60: Value: *
U9 = MEM_DDR3_MT41J128M16JT-125:K TR: MEM - DDR3 SDRAM 2GBIT 800MHZ - TFBGA-96; Voltage: 1.425 V ~ 1.575 V; Mfg: Micrel; Current: *; Power: *; Mfg Part Number: MT41J128M16JT-125; HelpURL: http://www.micron.com/~/media/Documents/Products/Data%20Sheet/DRAM/DDR3/2Gb_DDR3_SDRAM.pdf; CreatedBy: Jonathan Bouchard; Temperature: 0°C ~ 95°C (TC); Value: *; Precision: *; Package: TFBGA-96; Supplier 1: Digikey; Supplier Part Number 1: 557-1611-1-ND

## Sheet APP_1_PLL_m.SchDoc
size Tabloid; SheetNumber: 13; SheetTotal: 14; Sheet_Name: PLL; Size: 11x17
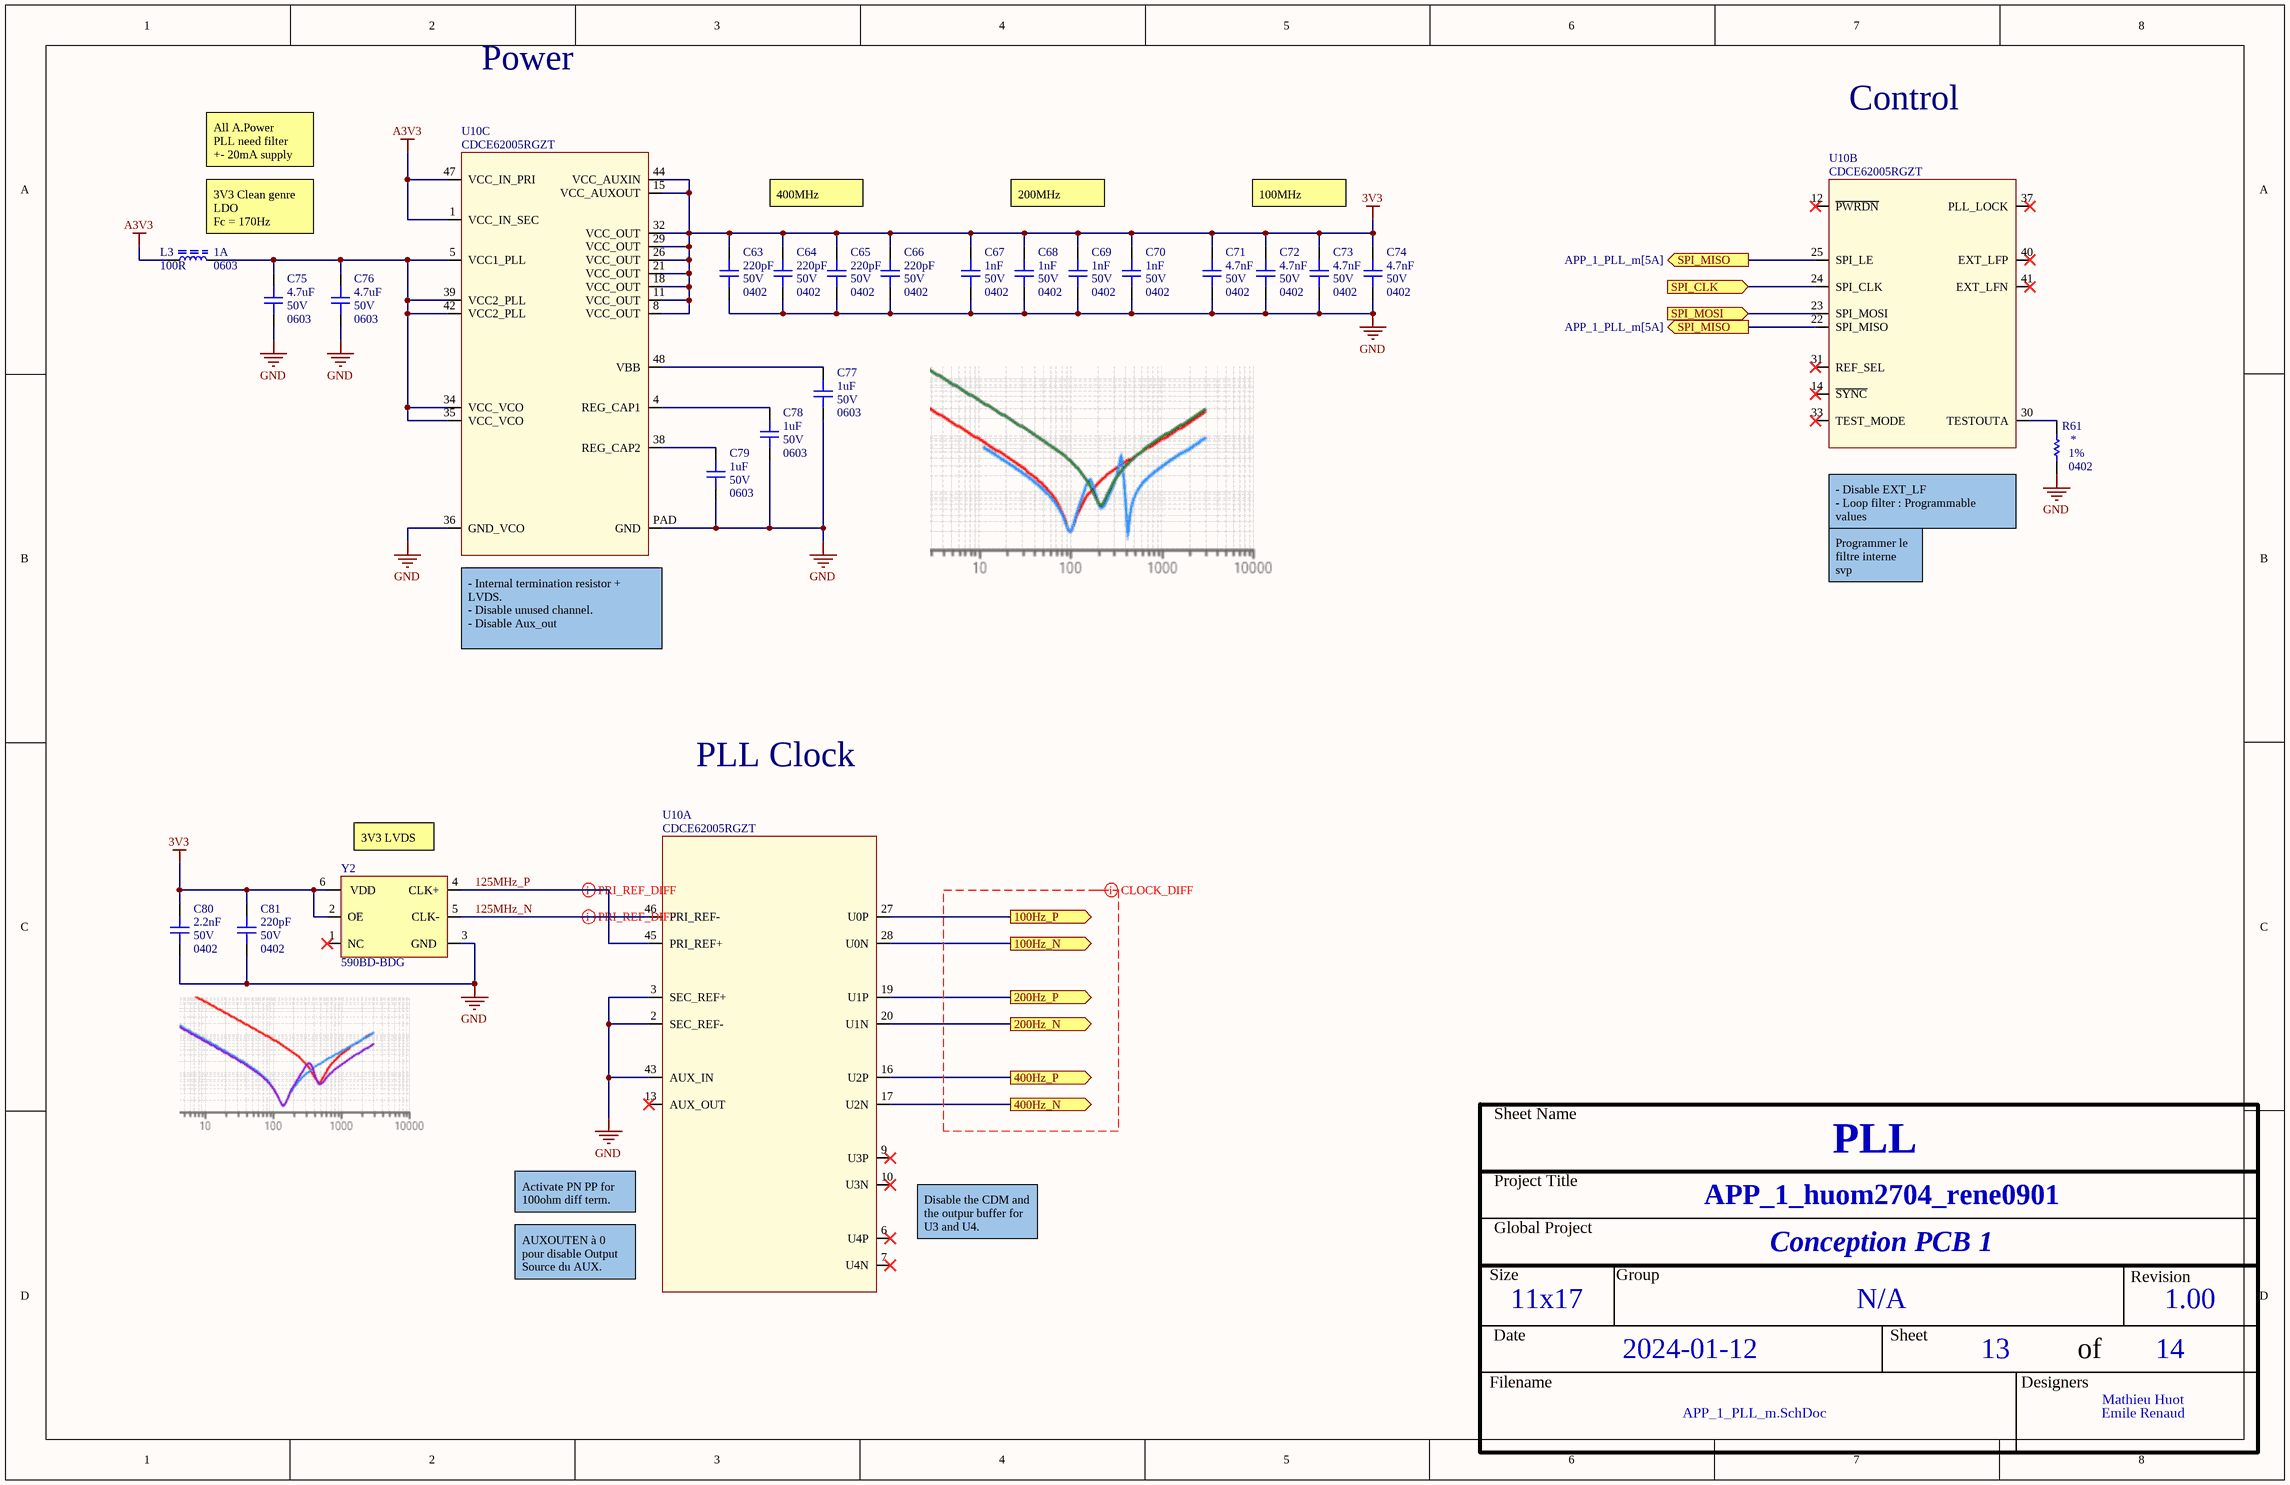
[diagram p4: APP_1_PLL_m.SchDoc]

### Parts
(Parts that share a designator on the sheet are numbered #1, #2 ... from top to bottom, then left to right.)
C63  value 220pF  Voltage: 50V  Package: 0402  [CAP_0402]  (hidden comment: CAP - 0402)
C64  value 220pF  Voltage: 50V  Package: 0402  [CAP_0402]  (hidden comment: CAP - 0402)
C65  value 220pF  Voltage: 50V  Package: 0402  [CAP_0402]  (hidden comment: CAP - 0402)
C66#1  value 220pF  Voltage: 50V  Package: 0402  [CAP_0402]  (hidden comment: CAP - 0402)
C67  value 1nF  Voltage: 50V  Package: 0402  [CAP_0402]  (hidden comment: CAP - 0402)
C68  value 1nF  Voltage: 50V  Package: 0402  [CAP_0402]  (hidden comment: CAP - 0402)
C69  value 1nF  Voltage: 50V  Package: 0402  [CAP_0402]  (hidden comment: CAP - 0402)
C70#1  value 1nF  Voltage: 50V  Package: 0402  [CAP_0402]  (hidden comment: CAP - 0402)
C71  value 4.7nF  Voltage: 50V  Package: 0402  [CAP_0402]  (hidden comment: CAP - 0402)
C72  value 4.7nF  Voltage: 50V  Package: 0402  [CAP_0402]  (hidden comment: CAP - 0402)
C73  value 4.7nF  Voltage: 50V  Package: 0402  [CAP_0402]  (hidden comment: CAP - 0402)
C74#1  value 4.7nF  Voltage: 50V  Package: 0402  [CAP_0402]  (hidden comment: CAP - 0402)
C75  value 4.7uF  Voltage: 50V  Package: 0603  [CAP_0603]  (hidden comment: CAP - 0603)
C76  value 4.7uF  Voltage: 50V  Package: 0603  [CAP_0603]  (hidden comment: CAP - 0603)
C77  value 1uF  Voltage: 50V  Package: 0603  [CAP_0603]  (hidden comment: CAP - 0603)
C78  value 1uF  Voltage: 50V  Package: 0603  [CAP_0603]  (hidden comment: CAP - 0603)
C79  value 1uF  Voltage: 50V  Package: 0603  [CAP_0603]  (hidden comment: CAP - 0603)
C80  value 2.2nF  Voltage: 50V  Package: 0402  [CAP_0402]  (hidden comment: CAP - 0402)
C81  value 220pF  Voltage: 50V  Package: 0402  [CAP_0402]  (hidden comment: CAP - 0402)
L3  value 100R  Current: 1A  Package: 0603  [FER_0603]  (hidden comment: FER - 0603)
R61  Package: 0402  Precision: 1%  [RES_0402]  (hidden comment: RES - 0402)
U10  CDCE62005RGZT  [TIM_CDCE62005RGZT]  (parts A,B,C of 3)
Y2  590BD-BDG  [OSC_590BD-BDG]

### Ports
100Hz_N (out), 100Hz_P (out), 200Hz_N (out), 200Hz_P (out), 400Hz_N (out), 400Hz_P (out), SPI_CLK (in), SPI_MISO (out, see APP_1_PLL_m[5A]), SPI_MOSI (in)

### Nets
3V3: C63.2 C64.2 C65.2 C66#1.2 C67.2 C68.2 C69.2 C70#1.2 C71.2 C72.2 C73.2 C74#1.2 C80.2 C81.2 U10.8(VCC_OUT) U10.11(VCC_OUT) U10.15(VCC_AUXOUT) U10.18(VCC_OUT) U10.21(VCC_OUT) U10.26(VCC_OUT) U10.29(VCC_OUT) U10.32(VCC_OUT) U10.44(VCC_AUXIN) Y2.2(OE) Y2.6(VDD)
A3V3: L3.2 U10.1(VCC_IN_SEC) U10.47(VCC_IN_PRI)
GND: C63.1 C64.1 C65.1 C66#1.1 C67.1 C68.1 C69.1 C70#1.1 C71.1 C72.1 C73.1 C74#1.1 C75.1 C76.1 C77.1 C78.1 C79.1 C80.1 C81.1 R61.1 U10.2(SEC_REF-) U10.3(SEC_REF+) U10.36(GND_VCO) U10.43(AUX_IN) U10.PAD(GND) Y2.3(GND)
100Hz_N: U10.28(U0N) ; port 100Hz_N
100Hz_P: U10.27(U0P) ; port 100Hz_P
125MHz_N: U10.46(PRI_REF-) Y2.5(CLK-)
125MHz_P: U10.45(PRI_REF+) Y2.4(CLK+)
200Hz_N: U10.20(U1N) ; port 200Hz_N
200Hz_P: U10.19(U1P) ; port 200Hz_P
400Hz_N: U10.17(U2N) ; port 400Hz_N
400Hz_P: U10.16(U2P) ; port 400Hz_P
SPI_CLK: U10.24(SPI_CLK) ; port SPI_CLK
SPI_MISO: U10.22(SPI_MISO) U10.25(SPI_LE) ; port SPI_MISO
SPI_MOSI: U10.23(SPI_MOSI) ; port SPI_MOSI
NetC75_2: C75.2 C76.2 L3.1 U10.5(VCC1_PLL) U10.34(VCC_VCO) U10.35(VCC_VCO) U10.39(VCC2_PLL) U10.42(VCC2_PLL)
NetC77_2: C77.2 U10.48(VBB)
NetC78_2: C78.2 U10.4(REG_CAP1)
NetC79_2: C79.2 U10.38(REG_CAP2)
NetR61_2: R61.2 U10.30(TESTOUTA)

Not connected (* = marked no-connect by the designer): U10 6(U4P)* 7(U4N)* 9(U3P)* 10(U3N)* 12(~{PWRDN})* 13(AUX_OUT)* 14(~{SYNC})* 31(REF_SEL)* 33(TEST_MODE)* 37(PLL_LOCK)* 40(EXT_LFP)* 41(EXT_LFN)*; Y2 1(NC)*

### Layout directives
differential pair: 125MHz_N, 125MHz_P, (no net found under the mark)

### Notes on the sheet
- Power
- All A.Power
  PLL need filter
  +- 20mA supply
- Control
- (near L3) 3V3 Clean genre LDO
  Fc = 170Hz
- 400MHz
- 200MHz
- 100MHz
- - Disable EXT_LF
  - Loop filter : Programmable values
  - Can program PLL_Lock
- Programmer le filtre interne svp
- (near U10) - Internal termination resistor + LVDS.
  - Disable unused channel.
  - Disable Aux_out
- PLL Clock
- (near Y2) 3V3 LVDS
- (near U10) Activate PN PP for 100ohm diff term.
- (near U10) Disable the CDM and the outpur buffer for U3 and U4.
- (near U10) AUXOUTEN à 0 pour disable Output Source du AUX.
- Sheet Name
- Project Title
- Global Project
- Size
- Group
- Revision
- Date
- Sheet
- of
- Filename
- Designers

### Library data of the parts
C63-C65 C66#1 C67-C69 C70#1 C71-C73 C74#1 C80 C81 = CAP - 0402: Precision: 10%; Current: *; CreatedBy: Jonathan Bouchard; Power: *
C75-C79 = CAP - 0603: Precision: 10%; Current: *; CreatedBy: Jonathan Bouchard; Power: *
R61 = RES - 0402: Voltage: 50V; Power: 1/16W; Current: *; CreatedBy: Jonathan Bouchard; Value: *
U10 = TIM_CDCE62005RGZT: TIM - CLK SYNTH JITTER CLEANER 3:5 - QFN-48; Voltage: 3 V ~ 3.6 V; Mfg: Texas Instruments; Current: *; Power: *; Mfg Part Number: CDCE62005RGZT; HelpURL: http://www.ti.com/lit/ds/symlink/cdce62005.pdf; CreatedBy: Jonathan Bouchard; Temperature: -40°C ~ 85°C; Value: *; Precision: *; Package: QFN-48; Supplier 1: Digikey; Supplier Part Number 1: 296-23947-1-ND
Y2 = OSC_590BD-BDG: TIM - OSC PROG 125MHz ~ 214.999MHz LVDS 3.3V 7PPM EN/DS - 6-SMD; Manufacturer #1: Silicon Labs; Current Rating: 100 mA (supply); Note: Spécifié la fréquence lors de la commande; Voltage rating: 3.3V (supply); Polarized: Yes; Value: ±7ppm (freq Stability), ±20ppm (freq stability total); Magnetic Material: UNKNOWN; GRAMS Lib Spec: 2.8; Manufacturer #2: *; Power Max: *; Part Number #1: 590BD-BDG; Part Number #2: *; HelpURL: https://www.silabs.com/documents/public/data-sheets/Si590-591.pdf; Supplier 1: Digi-Key; Supplier Part Number 1: 590BD-BDG-ND; Assembly Type: SMD; Temperature: -40°C ~ 85°C; Package: 6-SMD; CreatedBy/Date: from 590BD-CDG; Tolerance: *; VerifiedBy: Caroline Paulin / 3/10/2019; Cryo: UNKNOWN
L3 = FER - 0603: Voltage: *; CreatedBy: Jonathan Bouchard; Power: *; Precision: *

## Sheet APP_1_ADC_m.SchDoc
size Tabloid; SheetNumber: 9; SheetTotal: 14; Sheet_Name: ADC; Size: 11x17
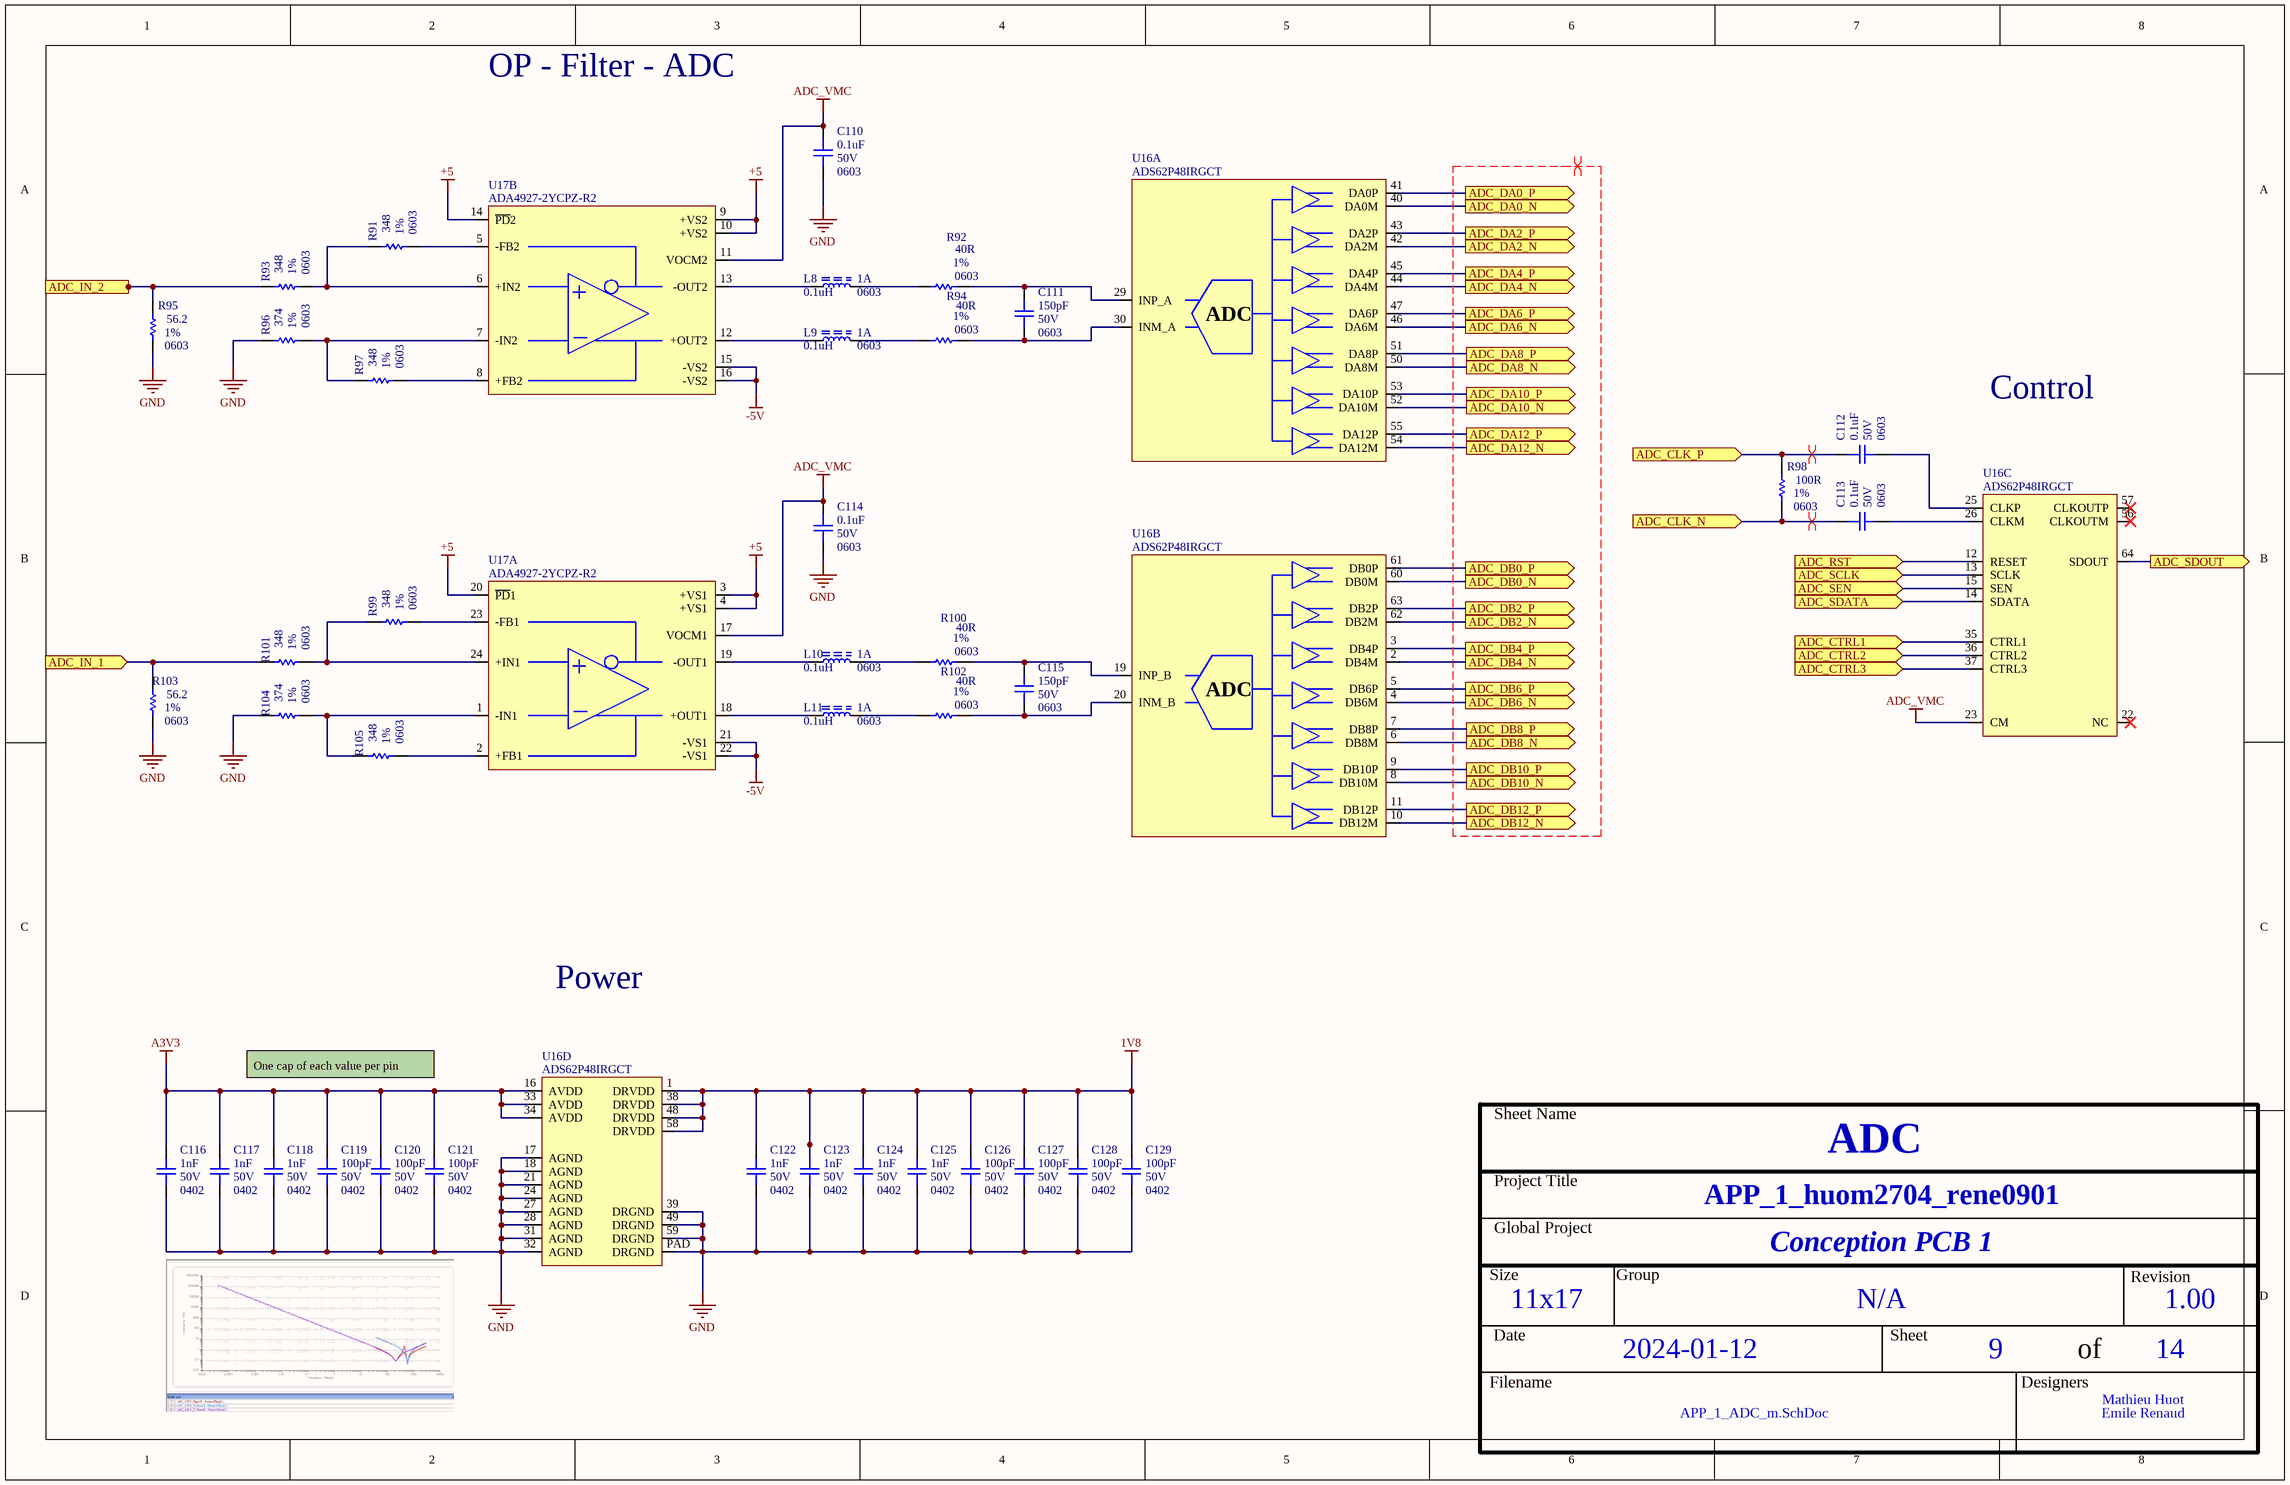
[diagram p5: APP_1_ADC_m.SchDoc]

### Parts
C110  value 0.1uF  Voltage: 50V  Package: 0603  [CAP_0603]  (hidden comment: CAP - 0603)
C111  value 150pF  Voltage: 50V  Package: 0603  [CAP_0603]  (hidden comment: CAP - 0603)
C112  value 0.1uF  Voltage: 50V  Package: 0603  [CAP_0603]  (hidden comment: CAP - 0603)
C113  value 0.1uF  Voltage: 50V  Package: 0603  [CAP_0603]  (hidden comment: CAP - 0603)
C114  value 0.1uF  Voltage: 50V  Package: 0603  [CAP_0603]  (hidden comment: CAP - 0603)
C115  value 150pF  Voltage: 50V  Package: 0603  [CAP_0603]  (hidden comment: CAP - 0603)
C116  value 1nF  Voltage: 50V  Package: 0402  [CAP_0402]  (hidden comment: CAP - 0402)
C117  value 1nF  Voltage: 50V  Package: 0402  [CAP_0402]  (hidden comment: CAP - 0402)
C118  value 1nF  Voltage: 50V  Package: 0402  [CAP_0402]  (hidden comment: CAP - 0402)
C119  value 100pF  Voltage: 50V  Package: 0402  [CAP_0402]  (hidden comment: CAP - 0402)
C120  value 100pF  Voltage: 50V  Package: 0402  [CAP_0402]  (hidden comment: CAP - 0402)
C121  value 100pF  Voltage: 50V  Package: 0402  [CAP_0402]  (hidden comment: CAP - 0402)
C122  value 1nF  Voltage: 50V  Package: 0402  [CAP_0402]  (hidden comment: CAP - 0402)
C123  value 1nF  Voltage: 50V  Package: 0402  [CAP_0402]  (hidden comment: CAP - 0402)
C124  value 1nF  Voltage: 50V  Package: 0402  [CAP_0402]  (hidden comment: CAP - 0402)
C125  value 1nF  Voltage: 50V  Package: 0402  [CAP_0402]  (hidden comment: CAP - 0402)
C126  value 100pF  Voltage: 50V  Package: 0402  [CAP_0402]  (hidden comment: CAP - 0402)
C127  value 100pF  Voltage: 50V  Package: 0402  [CAP_0402]  (hidden comment: CAP - 0402)
C128  value 100pF  Voltage: 50V  Package: 0402  [CAP_0402]  (hidden comment: CAP - 0402)
C129  value 100pF  Voltage: 50V  Package: 0402  [CAP_0402]  (hidden comment: CAP - 0402)
L8  value 0.1uH  Current: 1A  Package: 0603  [FER_0603]  (hidden comment: FER - 0603)
L9  value 0.1uH  Current: 1A  Package: 0603  [FER_0603]  (hidden comment: FER - 0603)
L10  value 0.1uH  Current: 1A  Package: 0603  [FER_0603]  (hidden comment: FER - 0603)
L11  value 0.1uH  Current: 1A  Package: 0603  [FER_0603]  (hidden comment: FER - 0603)
R91  value 348  Package: 0603  Precision: 1%  [RES_0603]  (hidden comment: RES - 0603)
R92  value 40R  Package: 0603  Precision: 1%  [RES_0603]  (hidden comment: RES - 0603)
R93  value 348  Package: 0603  Precision: 1%  [RES_0603]  (hidden comment: RES - 0603)
R94  value 40R  Package: 0603  Precision: 1%  [RES_0603]  (hidden comment: RES - 0603)
R95  value 56.2  Package: 0603  Precision: 1%  [RES_0603]  (hidden comment: RES - 0603)
R96  value 374  Package: 0603  Precision: 1%  [RES_0603]  (hidden comment: RES - 0603)
R97  value 348  Package: 0603  Precision: 1%  [RES_0603]  (hidden comment: RES - 0603)
R98  value 100R  Package: 0603  Precision: 1%  [RES_0603]  (hidden comment: RES - 0603)
R99  value 348  Package: 0603  Precision: 1%  [RES_0603]  (hidden comment: RES - 0603)
R100  value 40R  Package: 0603  Precision: 1%  [RES_0603]  (hidden comment: RES - 0603)
R101  value 348  Package: 0603  Precision: 1%  [RES_0603]  (hidden comment: RES - 0603)
R102  value 40R  Package: 0603  Precision: 1%  [RES_0603]  (hidden comment: RES - 0603)
R103  value 56.2  Package: 0603  Precision: 1%  [RES_0603]  (hidden comment: RES - 0603)
R104  value 374  Package: 0603  Precision: 1%  [RES_0603]  (hidden comment: RES - 0603)
R105  value 348  Package: 0603  Precision: 1%  [RES_0603]  (hidden comment: RES - 0603)
U16  ADS62P48IRGCT  [ADC_ADS62P48IRGCT]  (parts A,B,C,D of 4)
U17  ADA4927-2YCPZ-R2  [OPAMP_ADA4927-2YCPZ-R2]  (parts A,B of 2)

### Ports
ADC_CLK_N (in), ADC_CLK_P (in), ADC_CTRL1 (in), ADC_CTRL2 (in), ADC_CTRL3 (in), ADC_DA0_N (out), ADC_DA0_P (out), ADC_DA2_N (out), ADC_DA2_P (out), ADC_DA4_N (out), ADC_DA4_P (out), ADC_DA6_N (out), ADC_DA6_P (out), ADC_DA8_N (out), ADC_DA8_P (out), ADC_DA10_N (out), ADC_DA10_P (out), ADC_DA12_N (out), ADC_DA12_P (out), ADC_DB0_N (out), ADC_DB0_P (out), ADC_DB2_N (out), ADC_DB2_P (out), ADC_DB4_N (out), ADC_DB4_P (out), ADC_DB6_N (out), ADC_DB6_P (out), ADC_DB8_N (out), ADC_DB8_P (out), ADC_DB10_N (out), ADC_DB10_P (out), ADC_DB12_N (out), ADC_DB12_P (out), ADC_IN_1 (in, see APP_1_Connectors_m[5A]), ADC_IN_2 (in, see APP_1_Connectors_m[5A]), ADC_RST (in), ADC_SCLK (in), ADC_SDATA (in), ADC_SDOUT (out), ADC_SEN (in)

### Nets
1V8: C122.2 C123.2 C124.2 C125.2 C126.2 C127.2 C128.2 C129.2 U16.1(DRVDD) U16.38(DRVDD) U16.48(DRVDD) U16.58(DRVDD)
+5: U17.3(+VS1) U17.4(+VS1) U17.9(+VS2) U17.10(+VS2) U17.14(~{PD}2) U17.20(~{PD}1)
-5V: U17.15(-VS2) U17.16(-VS2) U17.21(-VS1) U17.22(-VS1)
A3V3: C116.2 C117.2 C118.2 C119.2 C120.2 C121.2 U16.16(AVDD) U16.33(AVDD) U16.34(AVDD)
ADC_VMC: C110.2 C114.2 U16.23(CM) U17.11(VOCM2) U17.17(VOCM1)
GND: C110.1 C114.1 C116.1 C117.1 C118.1 C119.1 C120.1 C121.1 C122.1 C123.1 C124.1 C125.1 C126.1 C127.1 C128.1 C129.1 R95.1 R96.2 R103.1 R104.2 U16.17(AGND) U16.18(AGND) U16.21(AGND) U16.24(AGND) U16.27(AGND) U16.28(AGND) U16.31(AGND) U16.32(AGND) U16.39(DRGND) U16.49(DRGND) U16.59(DRGND) U16.PAD(DRGND)
ADC_CLK_N: C113.2 R98.1 ; port ADC_CLK_N
ADC_CLK_P: C112.2 R98.2 ; port ADC_CLK_P
ADC_CTRL1: U16.35(CTRL1) ; port ADC_CTRL1
ADC_CTRL2: U16.36(CTRL2) ; port ADC_CTRL2
ADC_CTRL3: U16.37(CTRL3) ; port ADC_CTRL3
ADC_DA0_N: U16.40(DA0M) ; port ADC_DA0_N
ADC_DA0_P: U16.41(DA0P) ; port ADC_DA0_P
ADC_DA2_N: U16.42(DA2M) ; port ADC_DA2_N
ADC_DA2_P: U16.43(DA2P) ; port ADC_DA2_P
ADC_DA4_N: U16.44(DA4M) ; port ADC_DA4_N
ADC_DA4_P: U16.45(DA4P) ; port ADC_DA4_P
ADC_DA6_N: U16.46(DA6M) ; port ADC_DA6_N
ADC_DA6_P: U16.47(DA6P) ; port ADC_DA6_P
ADC_DA8_N: U16.50(DA8M) ; port ADC_DA8_N
ADC_DA8_P: U16.51(DA8P) ; port ADC_DA8_P
ADC_DA10_N: U16.52(DA10M) ; port ADC_DA10_N
ADC_DA10_P: U16.53(DA10P) ; port ADC_DA10_P
ADC_DA12_N: U16.54(DA12M) ; port ADC_DA12_N
ADC_DA12_P: U16.55(DA12P) ; port ADC_DA12_P
ADC_DB0_N: U16.60(DB0M) ; port ADC_DB0_N
ADC_DB0_P: U16.61(DB0P) ; port ADC_DB0_P
ADC_DB2_N: U16.62(DB2M) ; port ADC_DB2_N
ADC_DB2_P: U16.63(DB2P) ; port ADC_DB2_P
ADC_DB4_N: U16.2(DB4M) ; port ADC_DB4_N
ADC_DB4_P: U16.3(DB4P) ; port ADC_DB4_P
ADC_DB6_N: U16.4(DB6M) ; port ADC_DB6_N
ADC_DB6_P: U16.5(DB6P) ; port ADC_DB6_P
ADC_DB8_N: U16.6(DB8M) ; port ADC_DB8_N
ADC_DB8_P: U16.7(DB8P) ; port ADC_DB8_P
ADC_DB10_N: U16.8(DB10M) ; port ADC_DB10_N
ADC_DB10_P: U16.9(DB10P) ; port ADC_DB10_P
ADC_DB12_N: U16.10(DB12M) ; port ADC_DB12_N
ADC_DB12_P: U16.11(DB12P) ; port ADC_DB12_P
ADC_IN_1: R101.2 R103.2 ; port ADC_IN_1
ADC_IN_2: R93.2 R95.2 ; port ADC_IN_2
ADC_RST: U16.12(RESET) ; port ADC_RST
ADC_SCLK: U16.13(SCLK) ; port ADC_SCLK
ADC_SDATA: U16.14(SDATA) ; port ADC_SDATA
ADC_SDOUT: U16.64(SDOUT) ; port ADC_SDOUT
ADC_SEN: U16.15(SEN) ; port ADC_SEN
NetC111_1: C111.1 R94.1 U16.30(INM_A)
NetC111_2: C111.2 R92.1 U16.29(INP_A)
NetC112_1: C112.1 U16.25(CLKP)
NetC113_1: C113.1 U16.26(CLKM)
NetC115_1: C115.1 R102.1 U16.20(INM_B)
NetC115_2: C115.2 R100.1 U16.19(INP_B)
NetL8_1: L8.1 R92.2
NetL8_2: L8.2 U17.13(-OUT2)
NetL9_1: L9.1 R94.2
NetL9_2: L9.2 U17.12(+OUT2)
NetL10_1: L10.1 R100.2
NetL10_2: L10.2 U17.19(-OUT1)
NetL11_1: L11.1 R102.2
NetL11_2: L11.2 U17.18(+OUT1)
NetR91_1: R91.1 U17.5(-FB2)
NetR91_2: R91.2 R93.1 U17.6(+IN2)
NetR96_1: R96.1 R97.2 U17.7(-IN2)
NetR97_1: R97.1 U17.8(+FB2)
NetR99_1: R99.1 U17.23(-FB1)
NetR99_2: R99.2 R101.1 U17.24(+IN1)
NetR104_1: R104.1 R105.2 U17.1(-IN1)
NetR105_1: R105.1 U17.2(+FB1)

Not connected (* = marked no-connect by the designer): U16 22(NC)* 56(CLKOUTM)* 57(CLKOUTP)*

### Layout directives
differential pair: (no net found under the mark), ADC_CLK_N, ADC_CLK_P

### Notes on the sheet
- OP - Filter - ADC
- Control
- Power
- One cap of each value per pin
- Sheet Name
- Project Title
- Global Project
- Size
- Group
- Revision
- Date
- Sheet
- of
- Filename
- Designers
- (in symbol ADC_ADS62P48IRGCT, part A) ADC
- (in symbol ADC_ADS62P48IRGCT, part B) ADC

### Library data of the parts
C110-C115 = CAP - 0603: Precision: 10%; Current: *; CreatedBy: Jonathan Bouchard; Power: *
C116-C129 = CAP - 0402: Precision: 10%; Current: *; CreatedBy: Jonathan Bouchard; Power: *
U16 = ADC_ADS62P48IRGCT: ADC - 14 BIT 210MSPS SUAL - VQFN-64; Voltage: 3.15 V ~ 3.6 V / 1.7 V ~ 1.9 V; Mfg: Texas Instruments; Precision: 14 Bit; Current: *; Power: *; Mfg Part Number: ADS62P48IRGCT; HelpURL: http://www.ti.com/lit/ds/symlink/ads62p48.pdf; CreatedBy: Jonathan Bouchard; Temperature: -40°C ~ 85°C; Value: *; Package: VQFN-64; Supplier 1: Digikey; Supplier Part Number 1: 296-24611-1-ND
U17 = OPAMP_ADA4927-2YCPZ-R2: OPAMP - CFA 2.3GHZ - QFN-24; Voltage: 4.5 V ~ 11 V, ±2.25 V ~ 5.5 V; Current: 65mA; Mfg: Analog Devices; Power: *; Mfg Part Number: ADA4927-2YCPZ-R2; HelpURL: http://www.analog.com/media/en/technical-documentation/data-sheets/ADA4927-1_4927-2.pdf; CreatedBy: Jonathan Bouchard; Temperature: -40°C ~ 105°C; Value: *; Precision: *; Package: QFN-24; Supplier 1: Digikey; Supplier Part Number 1: ADA4927-2YCPZ-R2CT-ND
L8-L11 = FER - 0603: Voltage: *; CreatedBy: Jonathan Bouchard; Power: *; Precision: *
R91-R105 = RES - 0603: Current: *; CreatedBy: Jonathan Bouchard